# EAGLE schematic ccd_driver (EAGLE 9.1.3)

## Sheet 1 of 9: TODO
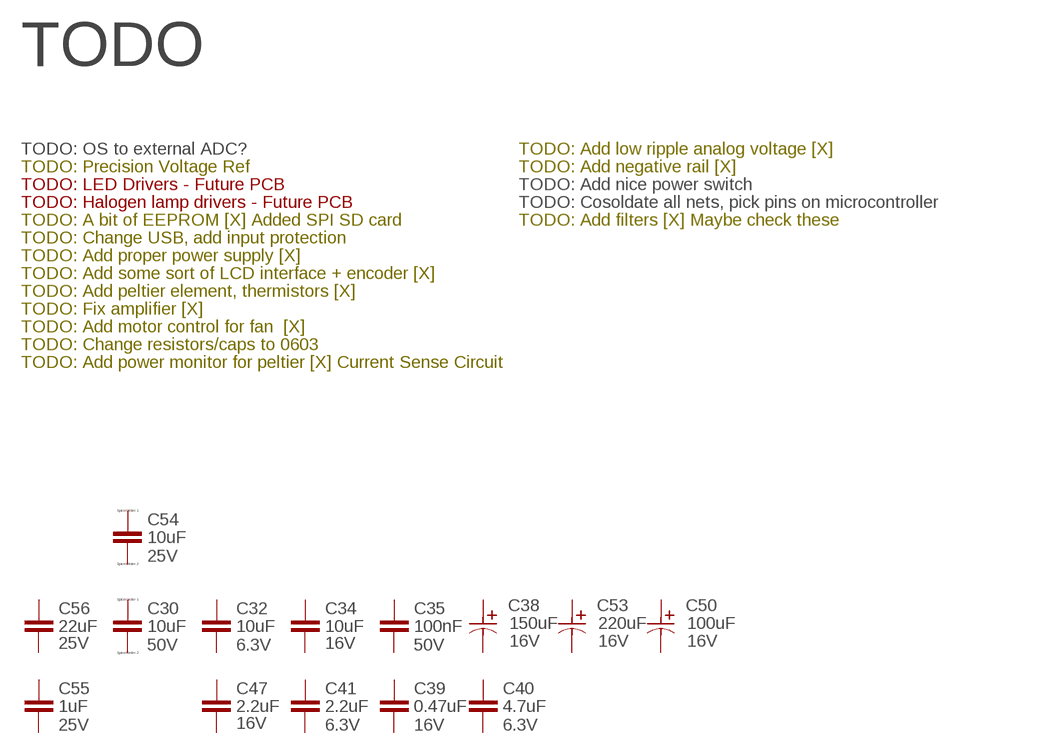
[diagram p0: schematic, sheet 1]

### Parts
C30  10uF  CC1206  [C1206]
C32  10uF  10PF-50V-5%(0603)  [0603-CAP]
C34  10uF  C-EUC0805  [C0805]
C35  100nF  10PF-50V-5%(0603)  [0603-CAP]
C38  UWZ1C151MCL1GS  [PCAP_6.3X7.7-ELECT]
C39  0.47uF  10PF-50V-5%(0603)  [0603-CAP]
C40  4.7uF  10PF-50V-5%(0603)  [0603-CAP]
C41  2.2uF  10PF-50V-5%(0603)  [0603-CAP]
C47  2.2uF  C-EUC0805  [C0805]
C50  EMVE160ADA101MF55G  UWZ1C151MCL1GS  [PCAP_6.3X7.7-ELECT]
C53  UWZ1C151MCL1GS  [PCAP_6.3X7.7-ELECT]
C54  10uF  CC1206  [C1206]
C55  1uF  10PF-50V-5%(0603)  [0603-CAP]
C56  22uF  C-EUC0805  [C0805]
Unconnected: C30.1 C30.2 C32.1 C32.2 C34.1 C34.2 C35.1 C35.2 C38.1 C38.2 C39.1 C39.2 C40.1 C40.2 C41.1 C41.2 C47.1 C47.2 C50.1 C50.2 C53.1 C53.2 C54.1 C54.2 C55.1 C55.2 C56.1 C56.2

### Notes on the sheet
- TODO: OS to external ADC? | TODO: Add low ripple analog voltage [X]
- TODO: Precision Voltage Ref | TODO: Add negative rail [X]
- TODO: LED Drivers - Future PCB | TODO: Add nice power switch
- TODO: Halogen lamp drivers - Future PCB | TODO: Cosoldate all nets, pick pins on microcontroller
- TODO: A bit of EEPROM [X] Added SPI SD card | TODO: Add filters [X] Maybe check these
- TODO: Change USB, add input protection
- TODO: Add proper power supply [X]
- TODO: Add some sort of LCD interface + encoder [X]
- TODO: Add peltier element, thermistors [X]
- TODO: Fix amplifier [X]
- TODO: Add motor control for fan  [X]
- TODO: Change resistors/caps to 0603
- TODO: Add power monitor for peltier [X] Current Sense Circuit

## Sheet 2 of 9: Power - Input
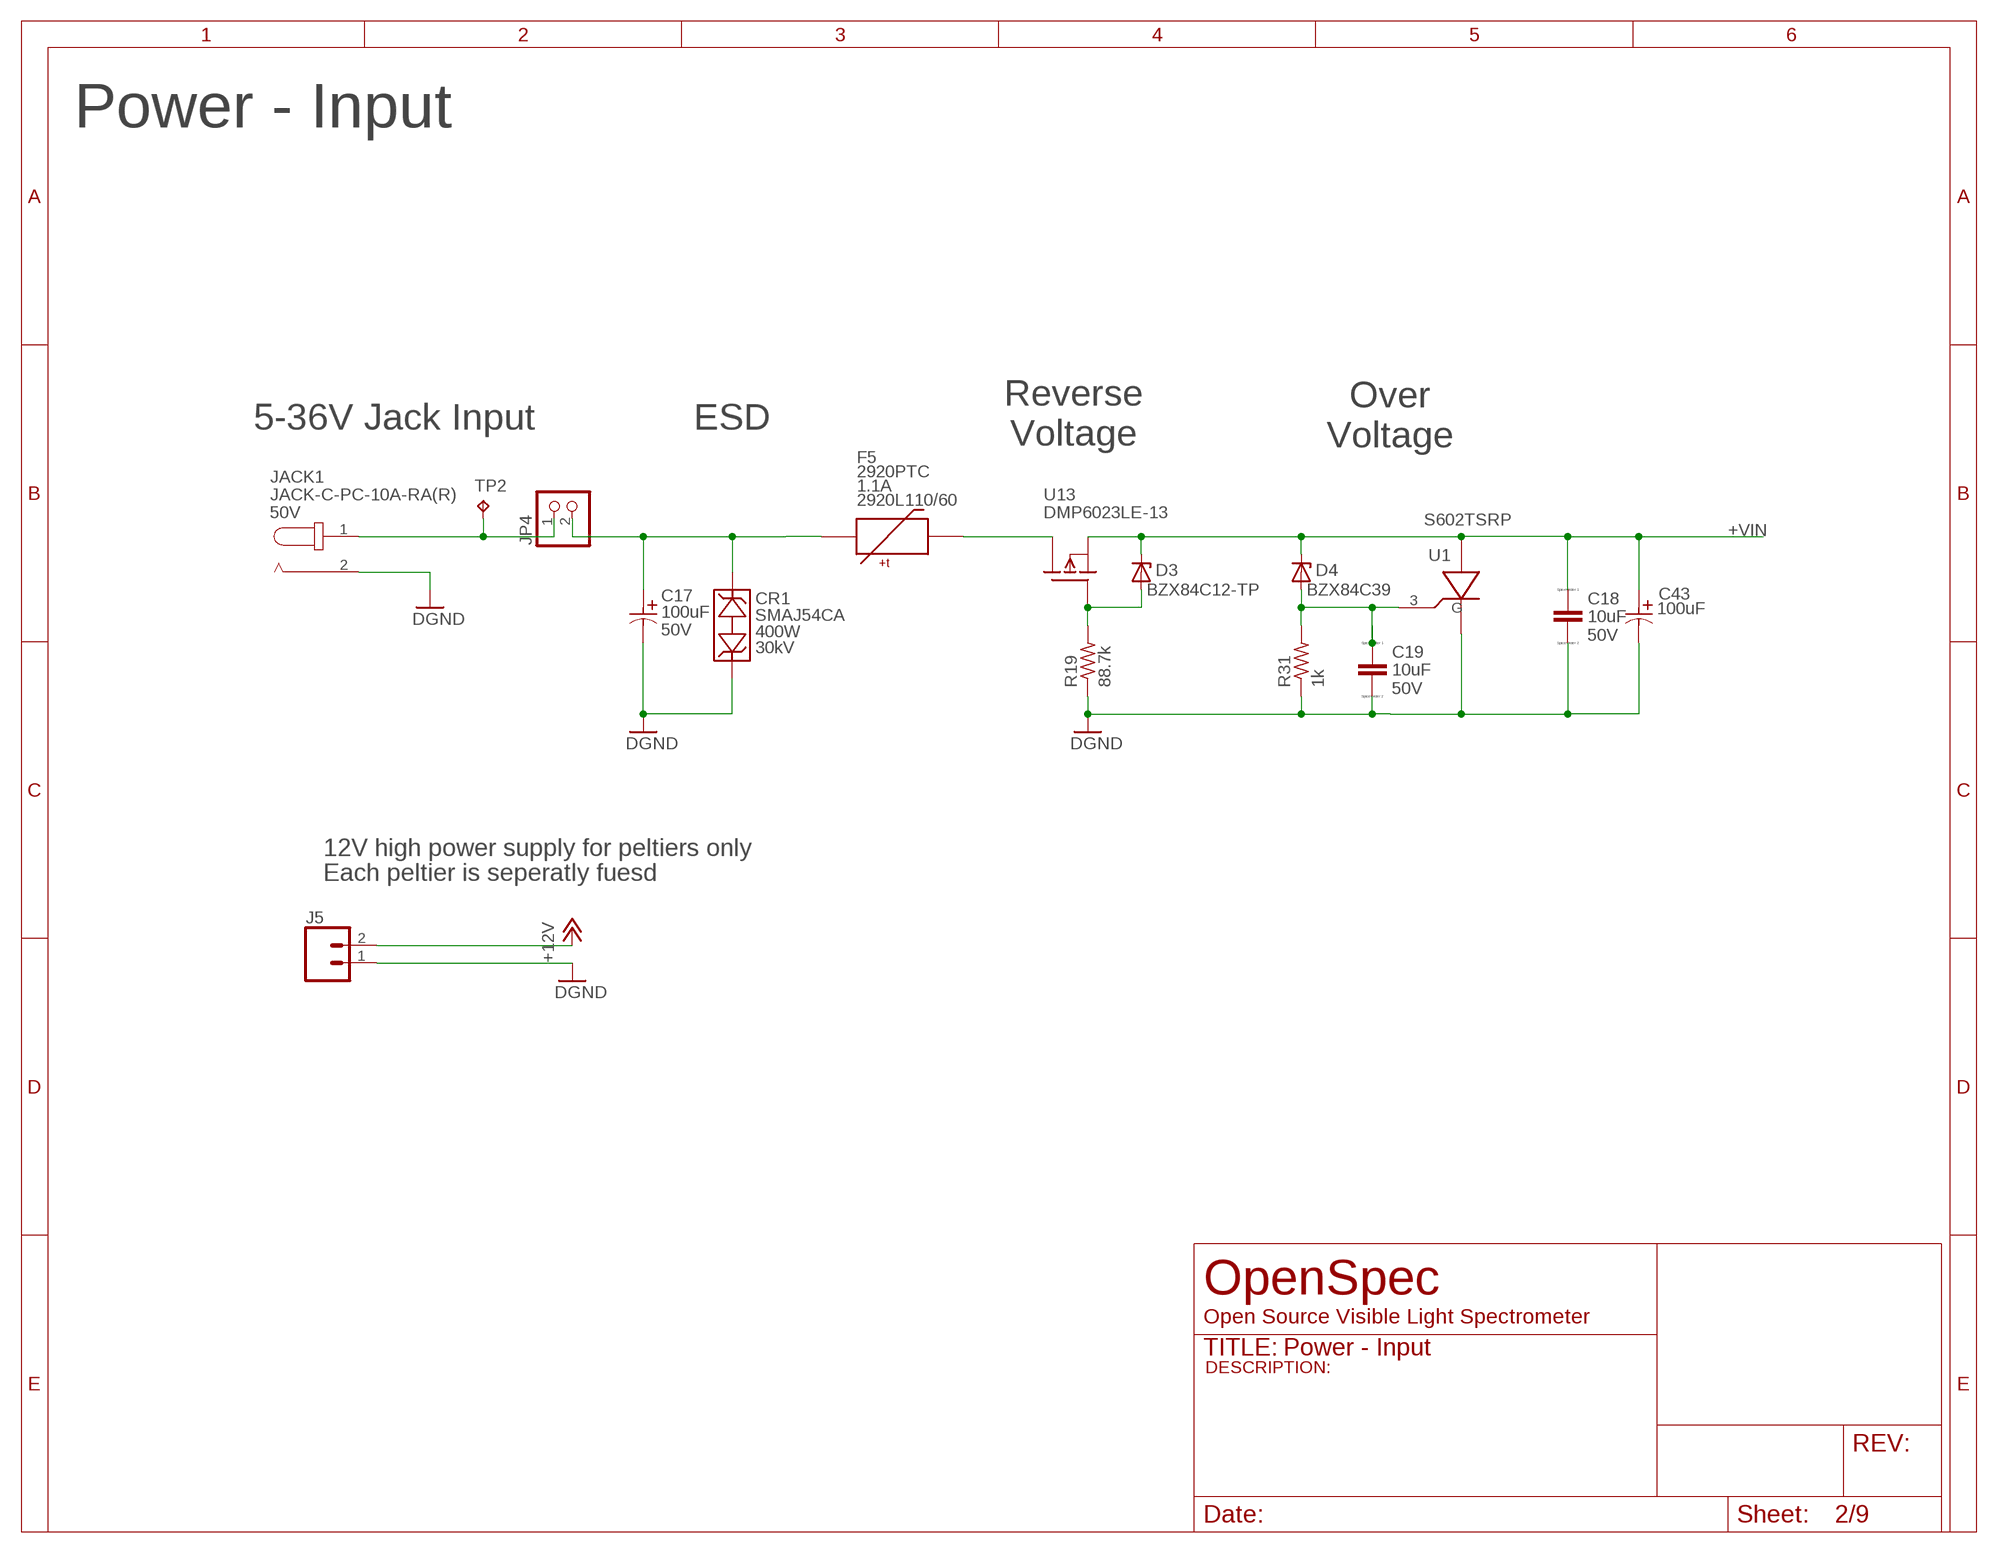
[diagram p1: schematic, sheet 2]

### Parts
C17  UWT1H101MNL1GS  [PCAP_8X10-ELECT]
C18  10uF  CC1206  [C1206]
C19  10uF  CC1206  [C1206]
C43  UWT1H101MNL1GS  [PCAP_8X10-ELECT]
CR1  SMAJ54CA  [SMASERIES]
D3  BZX84C12-TP  ZENER-DIODESOT23  [SOT23]
D4  BZX84C39  ZENER-DIODESOT23  [SOT23]
F5  2920PTC  [2920]
J5  CONN_023.5MM  [SCREWTERMINAL-3.5MM-2]
JACK1  JACK-C-PC-10A-RA(R)  [1939-1086-ND]
JP4  PINHD-1X2  [1X02]
R19  88.7k  R-US_R0603  [R0603]
R31  1k  R-US_R0603  [R0603]
TP2  TPPAD1-13  [P1-13]
U1  S602TSRP  BT168GW  [SOT223]
U13  DMP6023LE-13  [SOT-223]

### Nets
+12V: J5.2 ; also sheet 9
+VIN: C18.1 C43.1 D3.3(C) D4.3(C) U1.2(A) U13.3(S) ; also sheet 3
GND: C17.2 C18.2 C19.2 C43.2 CR1.2 J5.1 JACK1.2 R19.1 R31.1 U1.1(K) ; supply symbol labelled DGND ; also sheet 3,5,6,7,8,9
N$4: C17.1 CR1.1 F5.P$2 JP4.2
N$14: JACK1.1 JP4.1 TP2.TP
N$27: F5.P$1 U13.2(D) U13.TER(D)
N$33: D3.1(A) R19.2 U13.1(G)
N$34: C19.1 D4.1(A) R31.2 U1.3(G)

### Notes on the sheet
- 5-36V Jack Input | ESD
- Reverse
  Voltage
- Over
  Voltage
- 12V high power supply for peltiers only
- Each peltier is seperatly fuesd

## Sheet 3 of 9: Power - Regulators
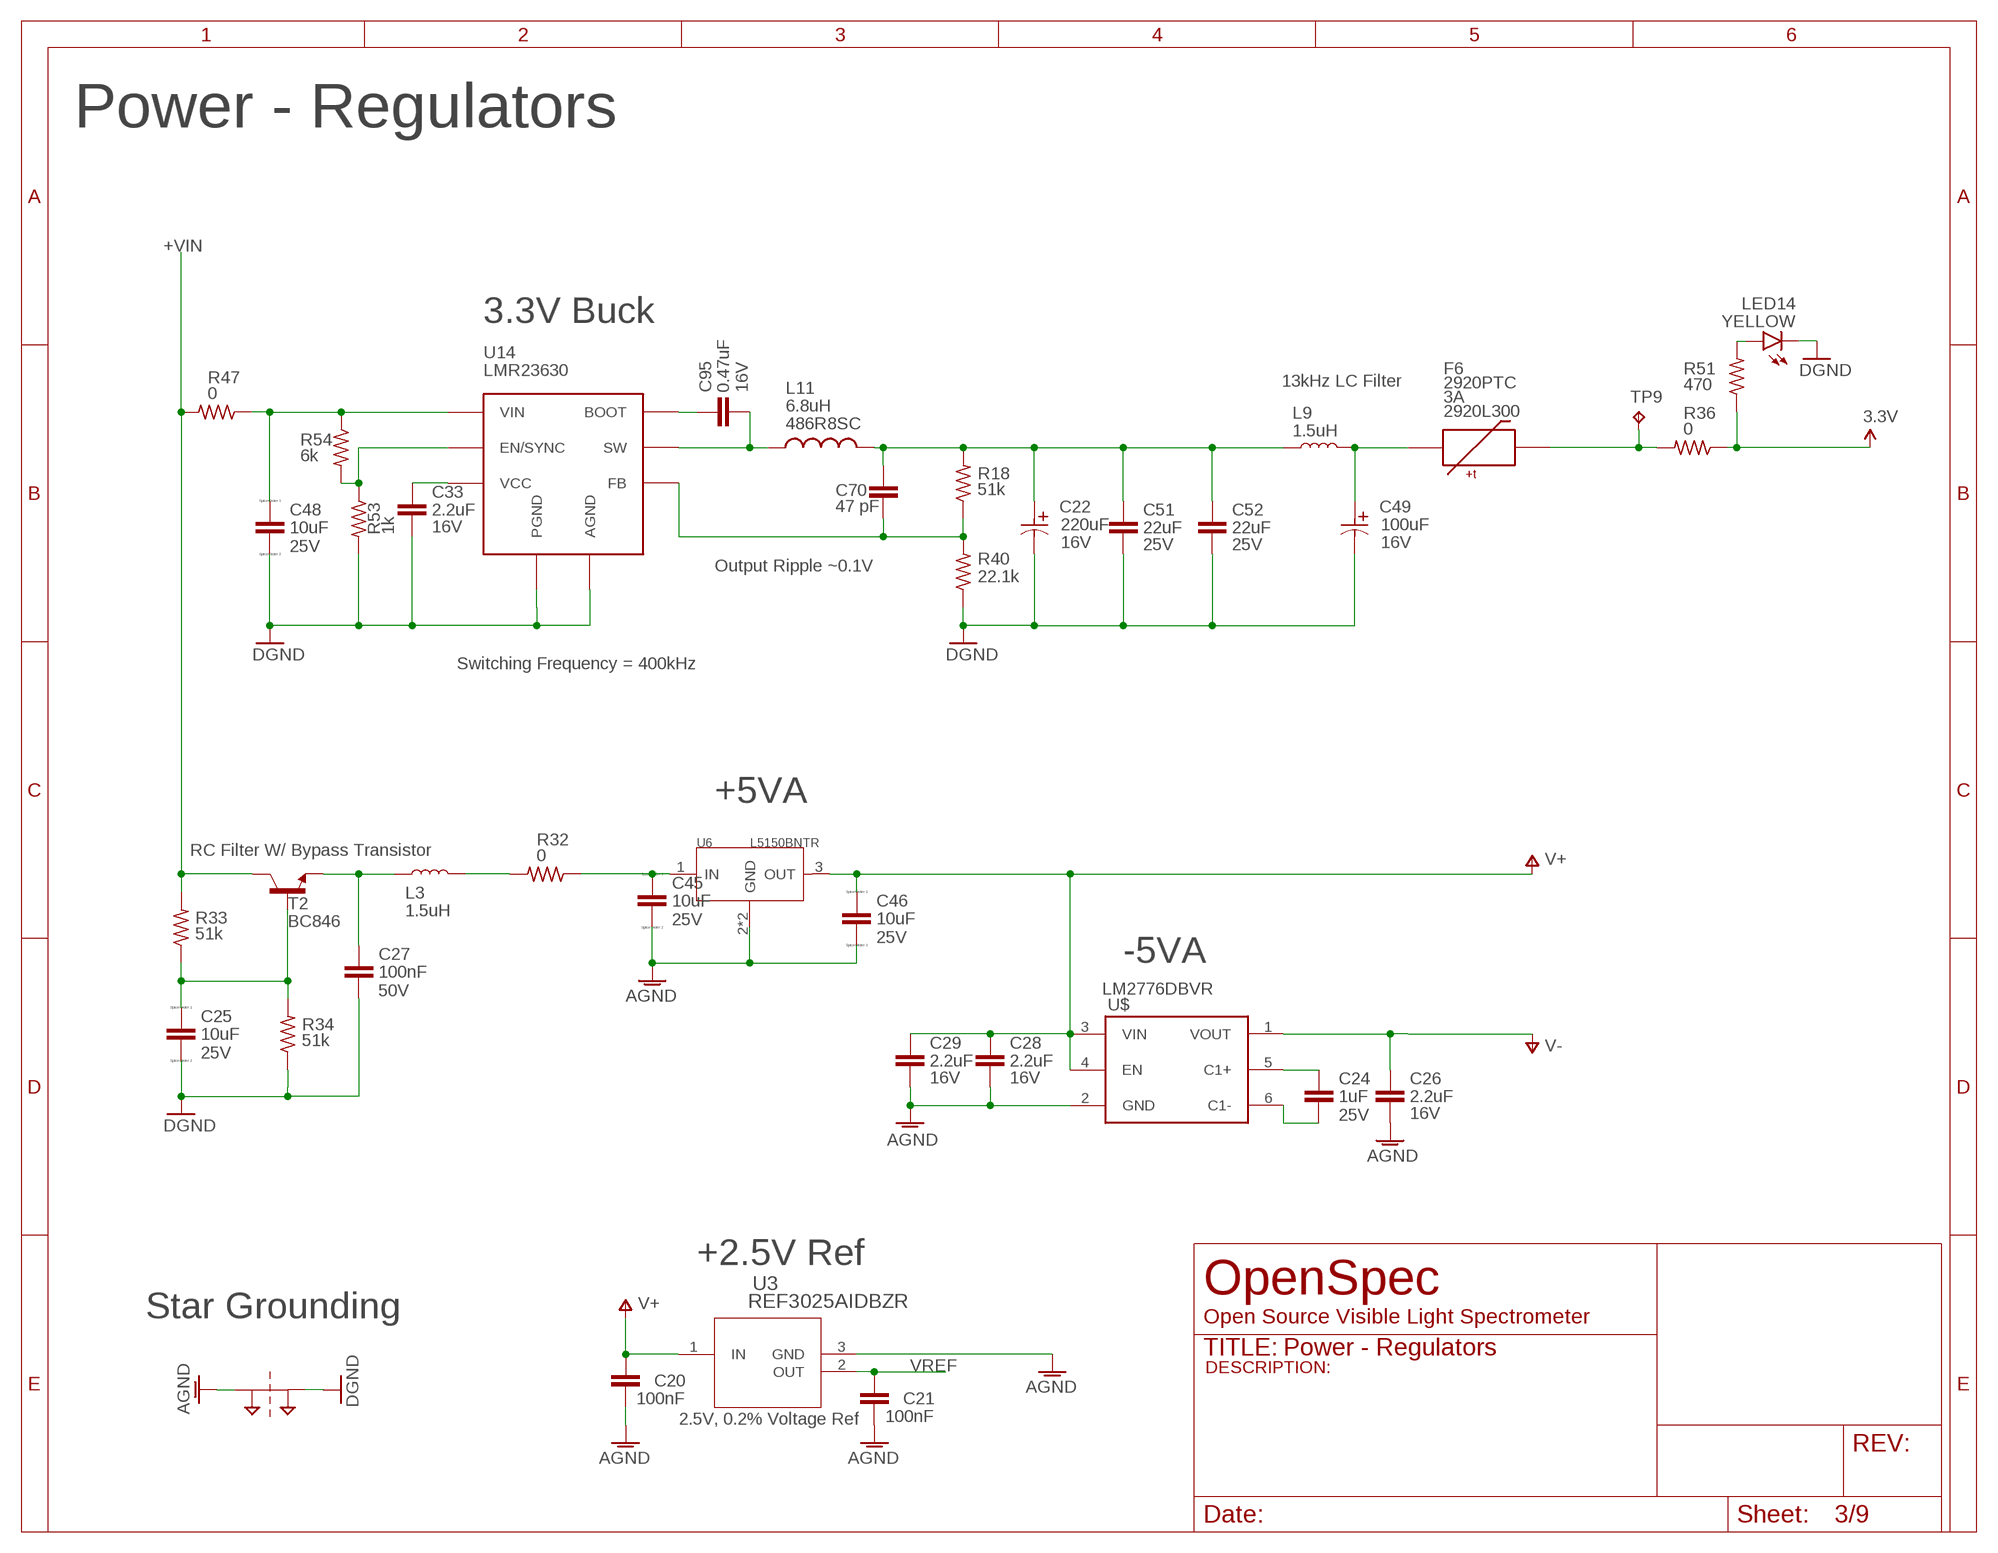
[diagram p2: schematic, sheet 3]

### Parts
C20  100nF  10PF-50V-5%(0603)  [0603-CAP]
C21  100nF  10PF-50V-5%(0603)  [0603-CAP]
C22  UWZ1C151MCL1GS  [PCAP_6.3X7.7-ELECT]
C24  1uF  10PF-50V-5%(0603)  [0603-CAP]
C25  10uF  CC1206  [C1206]
C26  2.2uF  C-EUC0805  [C0805]
C27  100nF  10PF-50V-5%(0603)  [0603-CAP]
C28  2.2uF  C-EUC0805  [C0805]
C29  2.2uF  C-EUC0805  [C0805]
C33  2.2uF  C-EUC0805  [C0805]
C45  10uF  CC1206  [C1206]
C46  10uF  CC1206  [C1206]
C48  10uF  CC1206  [C1206]
C49  EMVE160ADA101MF55G  UWZ1C151MCL1GS  [PCAP_6.3X7.7-ELECT]
C51  22uF  C-EUC0805  [C0805]
C52  22uF  C-EUC0805  [C0805]
C70  47 pF  10PF-50V-5%(0603)  [0603-CAP]
C95  0.47uF  10PF-50V-5%(0603)  [0603-CAP]
F6  2920PTC  [2920]
L3  CIGW252010GLR47MNE  [2520]
L9  CIGW252010GLR47MNE  [2520]
L11  486R8SC  [486R8SC]
LED14  SML-LX23  [3X2SMDLED]
R18  51k  R-US_R0603  [R0603]
R32  0  R-US_R0603  [R0603]
R33  51k  R-US_R0603  [R0603]
R34  51k  R-US_R0603  [R0603]
R36  0  R-US_R0603  [R0603]
R40  22.1k  R-US_R0603  [R0603]
R47  0  R-US_R0603  [R0603]
R51  470  R-US_R0603  [R0603]
R53  1k  R-US_R0603  [R0603]
R54  6k  R-US_R0603  [R0603]
SUPPLY21  2PT_GND_TIE  [2PT_GND_TIE]
T2  BC846  [SOT23]
TP9  TPPAD1-13  [P1-13]
U3  REF3025AIDBZR  [DBZ3]
U6  L5150BNTR  [SOT-223]
U14  LMR23630  [HSOIC-8]
U$  LM2776DBVR  [SOT23-6]

### Nets
3.3V: R36.1 R51.1 ; also sheet 4,5,7,8,9
+VIN: R33.2 R47.2 T2.3(C) ; also sheet 2
AGND: C20.2 C21.2 C26.2 C28.2 C29.2 C45.2 C46.2 SUPPLY21.P$1 U3.3(GND) U6.2(GND) U6.TER(GND) U$.2(GND) ; also sheet 4
GND: C22.2 C25.2 C27.2 C33.2 C48.2 C49.2 C51.2 C52.2 LED14.C R34.1 R40.1 R53.2 SUPPLY21.P$2 U14.P$6(AGND) U14.P$8(PGND) U14.PAD0(PGND) U14.PAD1(PGND) U14.PAD2(PGND) U14.PAD3(PGND) U14.PAD4(PGND) U14.PAD5(PGND) U14.PAD6(PGND) ; supply symbol labelled DGND ; also sheet 2,5,6,7,8,9
N$35: C45.1 R32.1 U6.1(IN)
N$36: L3.2 R32.2
N$38: C25.1 R33.1 R34.2 T2.1(B)
N$39: C27.1 L3.1 T2.2(E)
N$61: C33.1 U14.P$3(VCC)
N$66: R53.1 R54.2 U14.P$5(EN/SYNC)
N$67: C48.1 R47.1 R54.1 U14.P$7(VIN)
N$70: C70.2 R18.1 R40.2 U14.P$4(FB)
N$76: C95.2 L11.P$1 U14.P$1(SW)
N$79: C95.1 U14.P$2(BOOT)
N$88: C22.1 C51.1 C52.1 C70.1 L9.1 L11.P$2 R18.2
N$89: F6.P$1 R36.2 TP9.TP
N$91: LED14.A R51.2
N$93: C24.1 U$.5(C1+)
N$94: C24.2 U$.6(C1-)
N$95: C49.1 F6.P$2 L9.2
V+: C20.1 C28.1 C29.1 C46.1 U3.1(IN) U6.3(OUT) U$.3(VIN) U$.4(EN) ; also sheet 4
V-: C26.1 U$.1(VOUT) ; also sheet 4
VREF: C21.1 U3.2(OUT)

### Notes on the sheet
- 3.3V Buck
- 13kHz LC Filter
- Output Ripple ~0.1V
- Switching Frequency = 400kHz
- +5VA
- RC Filter W/ Bypass Transistor
- -5VA
- +2.5V Ref
- Star Grounding
- 2.5V, 0.2% Voltage Ref

## Sheet 4 of 9: CCD, Analog, & ADC
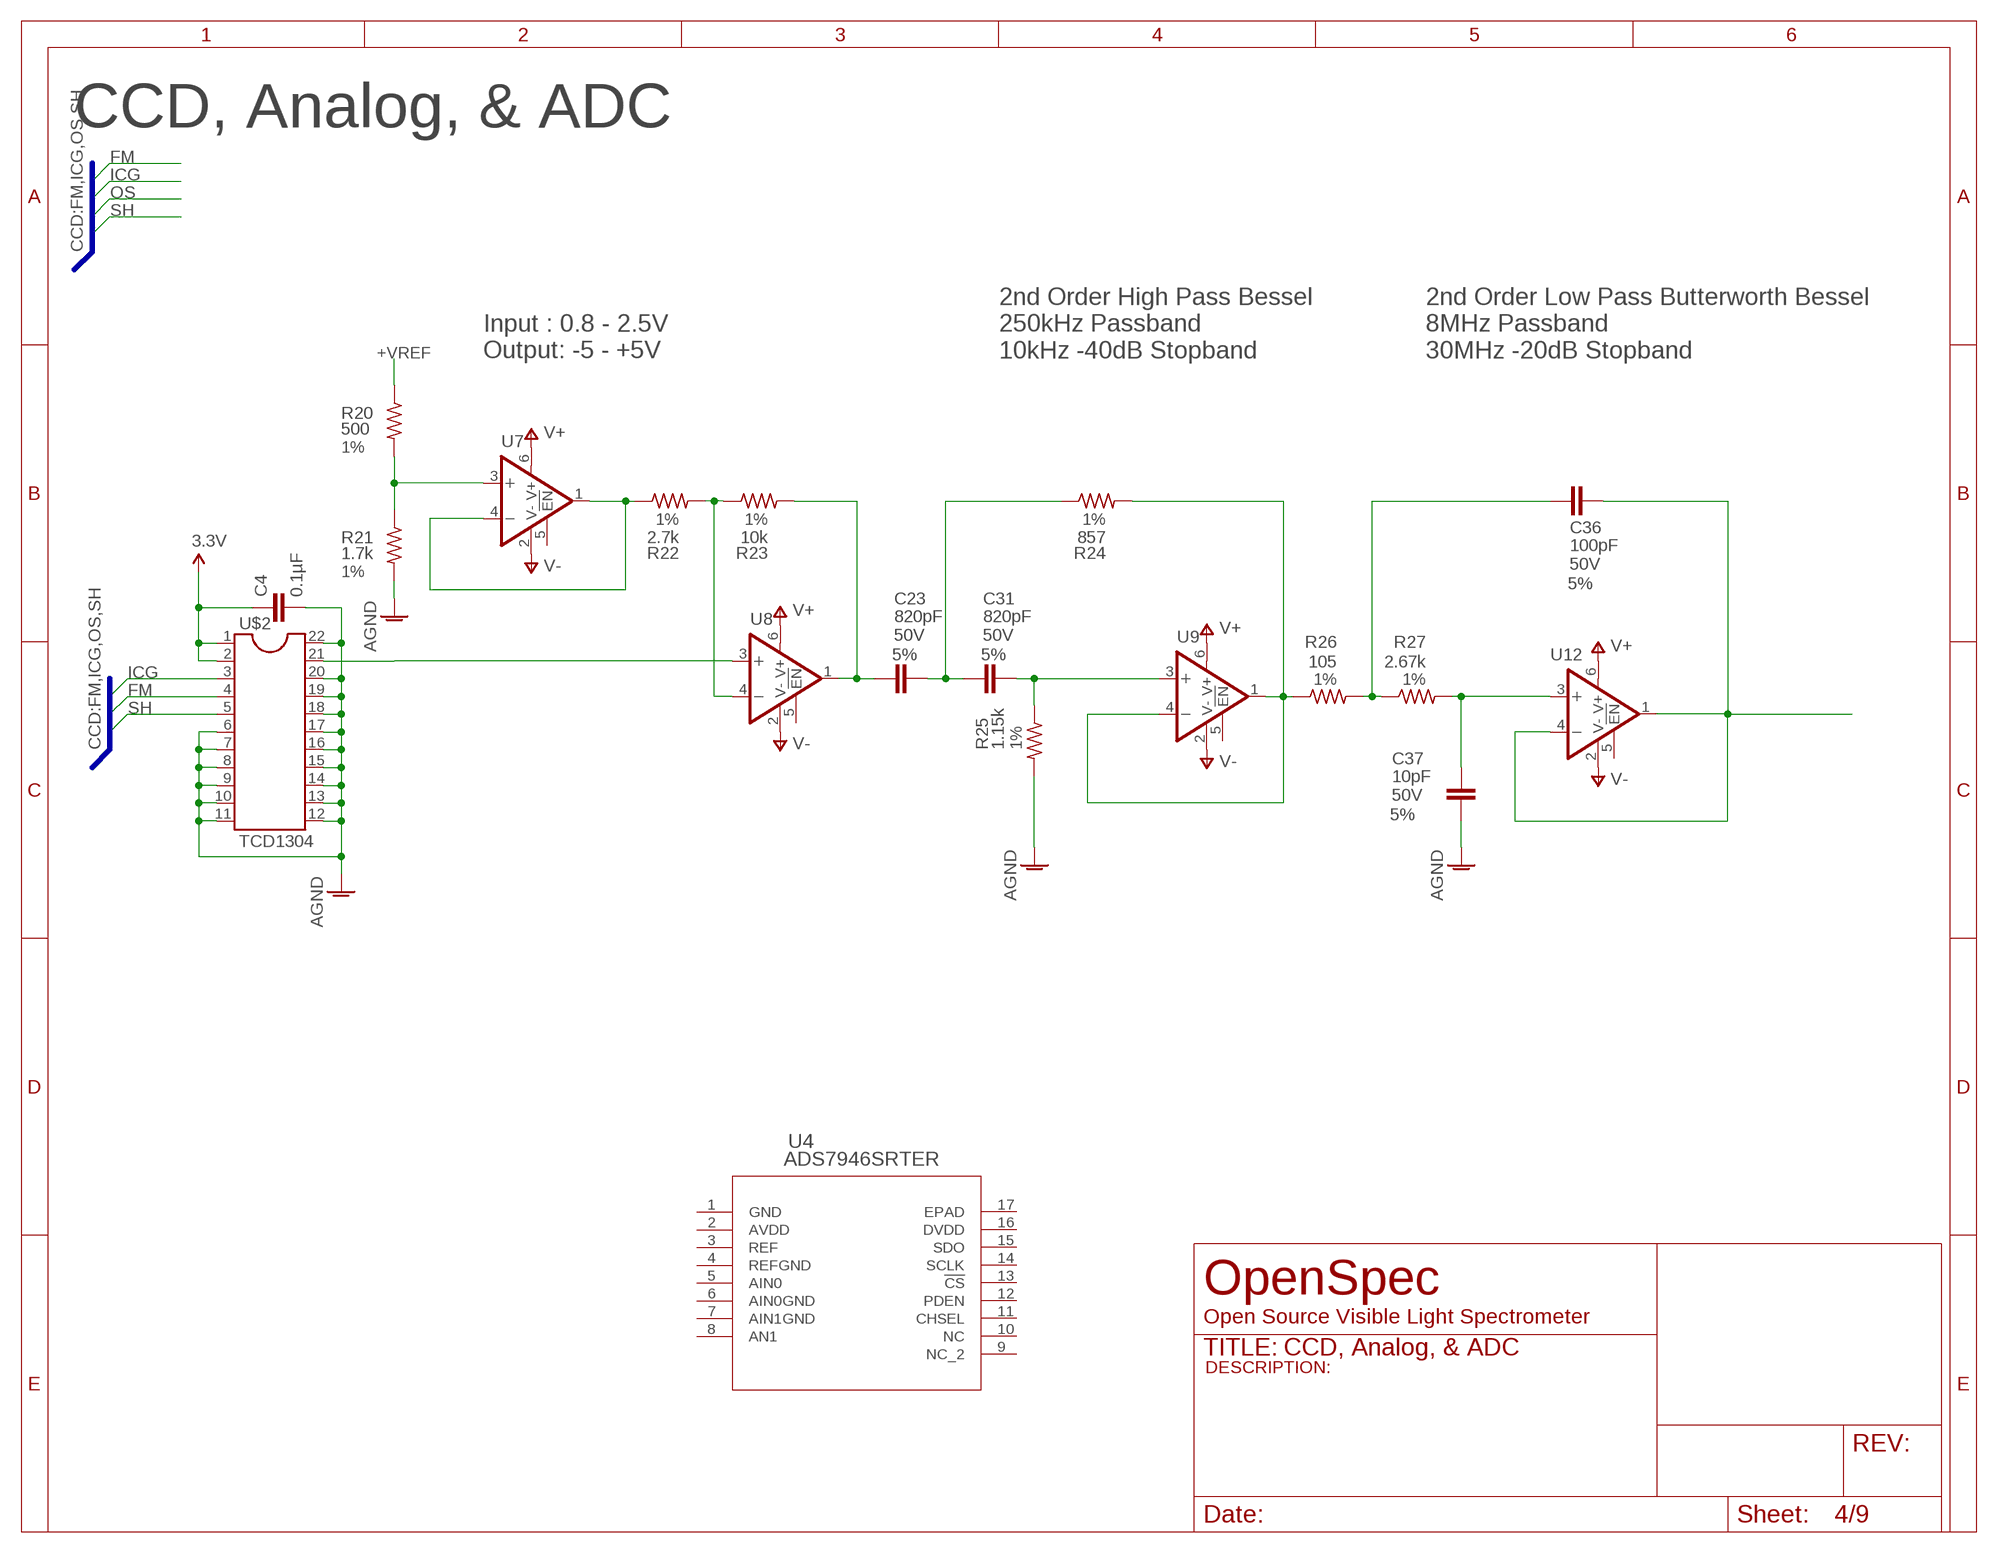
[diagram p3: schematic, sheet 4]

### Parts
C4  0.1µF  C-EUC1206  [C1206]
C23  820pF  10PF-50V-5%(0603)  [0603-CAP]
C31  820pF  10PF-50V-5%(0603)  [0603-CAP]
C36  100pF  10PF-50V-5%(0603)  [0603-CAP]
C37  10pF  10PF-50V-5%(0603)  [0603-CAP]
R20  500  R-US_R0603  [R0603]
R21  1.7k  R-US_R0603  [R0603]
R22  2.7k  R-US_R0603  [R0603]
R23  10k  R-US_R0603  [R0603]
R24  857  R-US_R0603  [R0603]
R25  1.15k  R-US_R0603  [R0603]
R26  105  R-US_R0603  [R0603]
R27  2.67k  R-US_R0603  [R0603]
U4  ADS7946SRTER  [RTE16_1P7X1P7]
U7  ADA4807-1ARJZ-R2  [RJ_6]
U8  ADA4807-1ARJZ-R2  [RJ_6]
U9  ADA4807-1ARJZ-R2  [RJ_6]
U12  ADA4807-1ARJZ-R2  [RJ_6]
U$2  TCD1304  [TCD1304]

### Nets
3.3V: C4.1 U$2.1 U$2.2 ; also sheet 3,5,7,8,9
+VREF: R20.1
AGND: C4.2 C37.1 R21.2 R25.2 U$2.6 U$2.7 U$2.8 U$2.9 U$2.10 U$2.11 U$2.12 U$2.13 U$2.14 U$2.15 U$2.16 U$2.17 U$2.18 U$2.19 U$2.20 U$2.22 ; also sheet 3
FM: U$2.4 ; also sheet 7
ICG: U$2.3 ; also sheet 7
N$5: U8.3(+IN) U$2.21
N$6: R20.2 R21.1 U7.3(+IN)
N$25: R22.1 U7.1(OUT) U7.4(-IN)
N$28: R22.2 R23.1 U8.4(-IN)
N$29: C23.1 R23.2 U8.1(OUT)
N$30: C23.2 C31.1 R24.1
N$31: C31.2 R25.1 U9.3(+IN)
N$32: R24.2 R26.1 U9.1(OUT) U9.4(-IN)
N$40: C37.2 R27.2 U12.3(+IN)
N$41: C36.1 R26.2 R27.1
N$42: C36.2 U12.1(OUT) U12.4(-IN)
SH: U$2.5 ; also sheet 7
V+: U7.6(V+) U8.6(V+) U9.6(V+) U12.6(V+) ; also sheet 3
V-: U7.2(V-) U8.2(V-) U9.2(V-) U12.2(V-) ; also sheet 3
Unconnected: U4.5(AIN0) U4.6(AIN0GND) U4.7(AIN1GND) U4.8(AN1) U4.9(NC_2) U4.10(NC) U4.11(CHSEL) U4.12(PDEN) U4.13(!CS) U4.14(SCLK) U4.15(SDO) U7.5(!EN) U8.5(!EN) U9.5(!EN) U12.5(!EN)

### Buses
CCD:FM,ICG,OS,SH

### Notes on the sheet
- Input : 0.8 - 2.5V
  Output: -5 - +5V
- 2nd Order High Pass Bessel
  250kHz Passband
  10kHz -40dB Stopband
- 2nd Order Low Pass Butterworth Bessel
  8MHz Passband
  30MHz -20dB Stopband

## Sheet 5 of 9: TFT Screen & Encoder
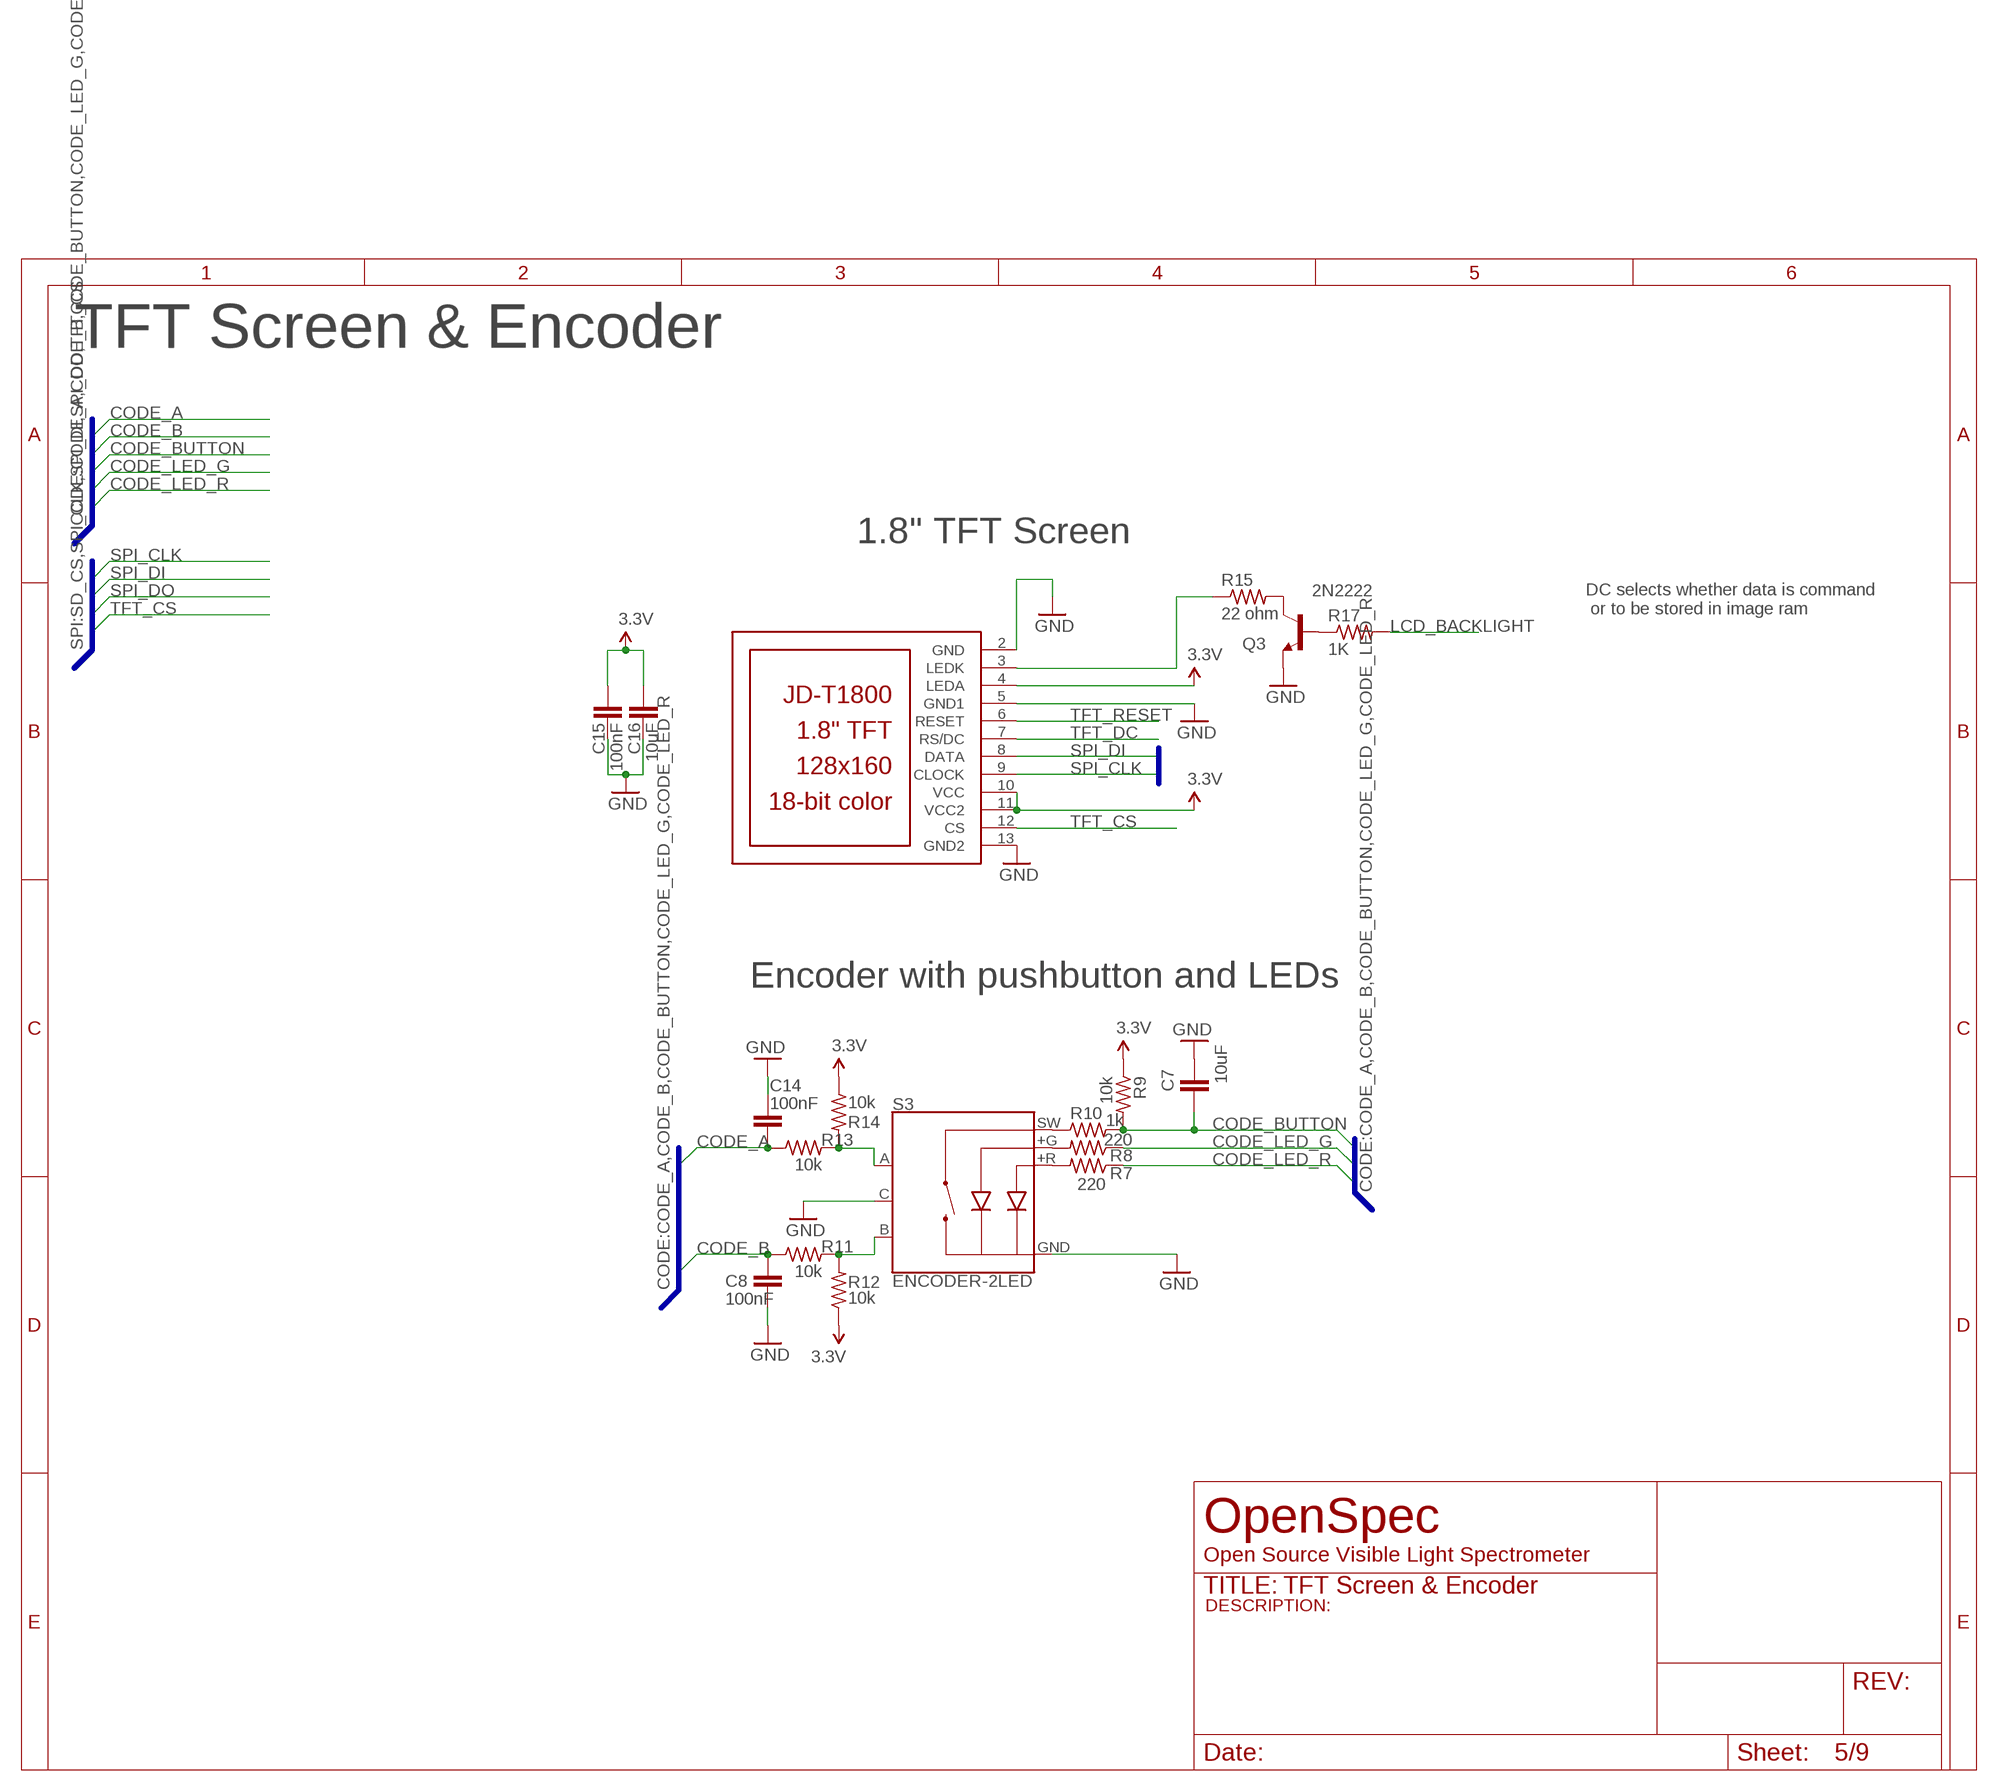
[diagram p4: schematic, sheet 5]

### Parts
C7  10uF  10PF-50V-5%(0603)  [0603-CAP]
C8  100nF  10PF-50V-5%(0603)  [0603-CAP]
C14  100nF  10PF-50V-5%(0603)  [0603-CAP]
C15  100nF  10PF-50V-5%(0603)  [0603-CAP]
C16  10uF  10PF-50V-5%(0603)  [0603-CAP]
Q3  2N2222  MMBT2222ALT1-NPN-SOT23-BEC  [SOT23-BEC]
R7  220  R-US_R0603  [R0603]
R8  220  R-US_R0603  [R0603]
R9  10k  R-US_R0603  [R0603]
R10  1k  R-US_R0603  [R0603]
R11  10k  R-US_R0603  [R0603]
R12  10k  R-US_R0603  [R0603]
R13  10k  R-US_R0603  [R0603]
R14  10k  R-US_R0603  [R0603]
R15  22 ohm  R-US_R0805  [R0805]
R17  1K  R-US_R0805  [R0805]
S3  ENCODER-2LED  [ENCODER_LED_2]
U$10  JD-T1800  [JD-T1800]

### Nets
3.3V: C15.1 C16.1 R9.1 R12.1 R14.1 U$10.4(LEDA) U$10.10(VCC) U$10.11(VCC2) ; also sheet 3,4,7,8,9
CODE_A: C14.2 R13.1
CODE_B: C8.1 R11.1
CODE_BUTTON: C7.2 R9.2 R10.2
CODE_LED_G: R8.1
CODE_LED_R: R7.1
GND: C7.1 C8.2 C14.1 C15.2 C16.2 Q3.E S3.C S3.GND(-) U$10.2(GND) U$10.5(GND1) U$10.13(GND2) ; also sheet 2,3,6,7,8,9
LCD_BACKLIGHT: R17.2
N$3: R7.2 S3.+R
N$8: R8.2 S3.+G
N$9: R10.1 S3.SW
N$10: R13.2 R14.2 S3.A
N$20: R11.2 R12.2 S3.B
N$22: R15.1 U$10.3(LEDK)
N$23: Q3.C R15.2
N$24: Q3.B R17.1
SPI_CLK: U$10.9(CLOCK) ; also sheet 8
SPI_DI: U$10.8(DATA) ; also sheet 8
TFT_CS: U$10.12(CS)
TFT_DC: U$10.7(RS/DC)
TFT_RESET: U$10.6(RESET)

### Buses
SPI:SD_CS,SPI_CLK,SPI_DI,SPI_DO,TFT_CS
CODE:CODE_A,CODE_B,CODE_BUTTON,CODE_LED_G,CODE_LED_R
GND,CODE_LED_R,CODE_LED_G,CODE_BUTTON,N$20,CODE_B,N$10,CODE_A

### Notes on the sheet
- 1.8" TFT Screen
- DC selects whether data is command
   or to be stored in image ram
- Encoder with pushbutton and LEDs

## Sheet 6 of 9: USB Input
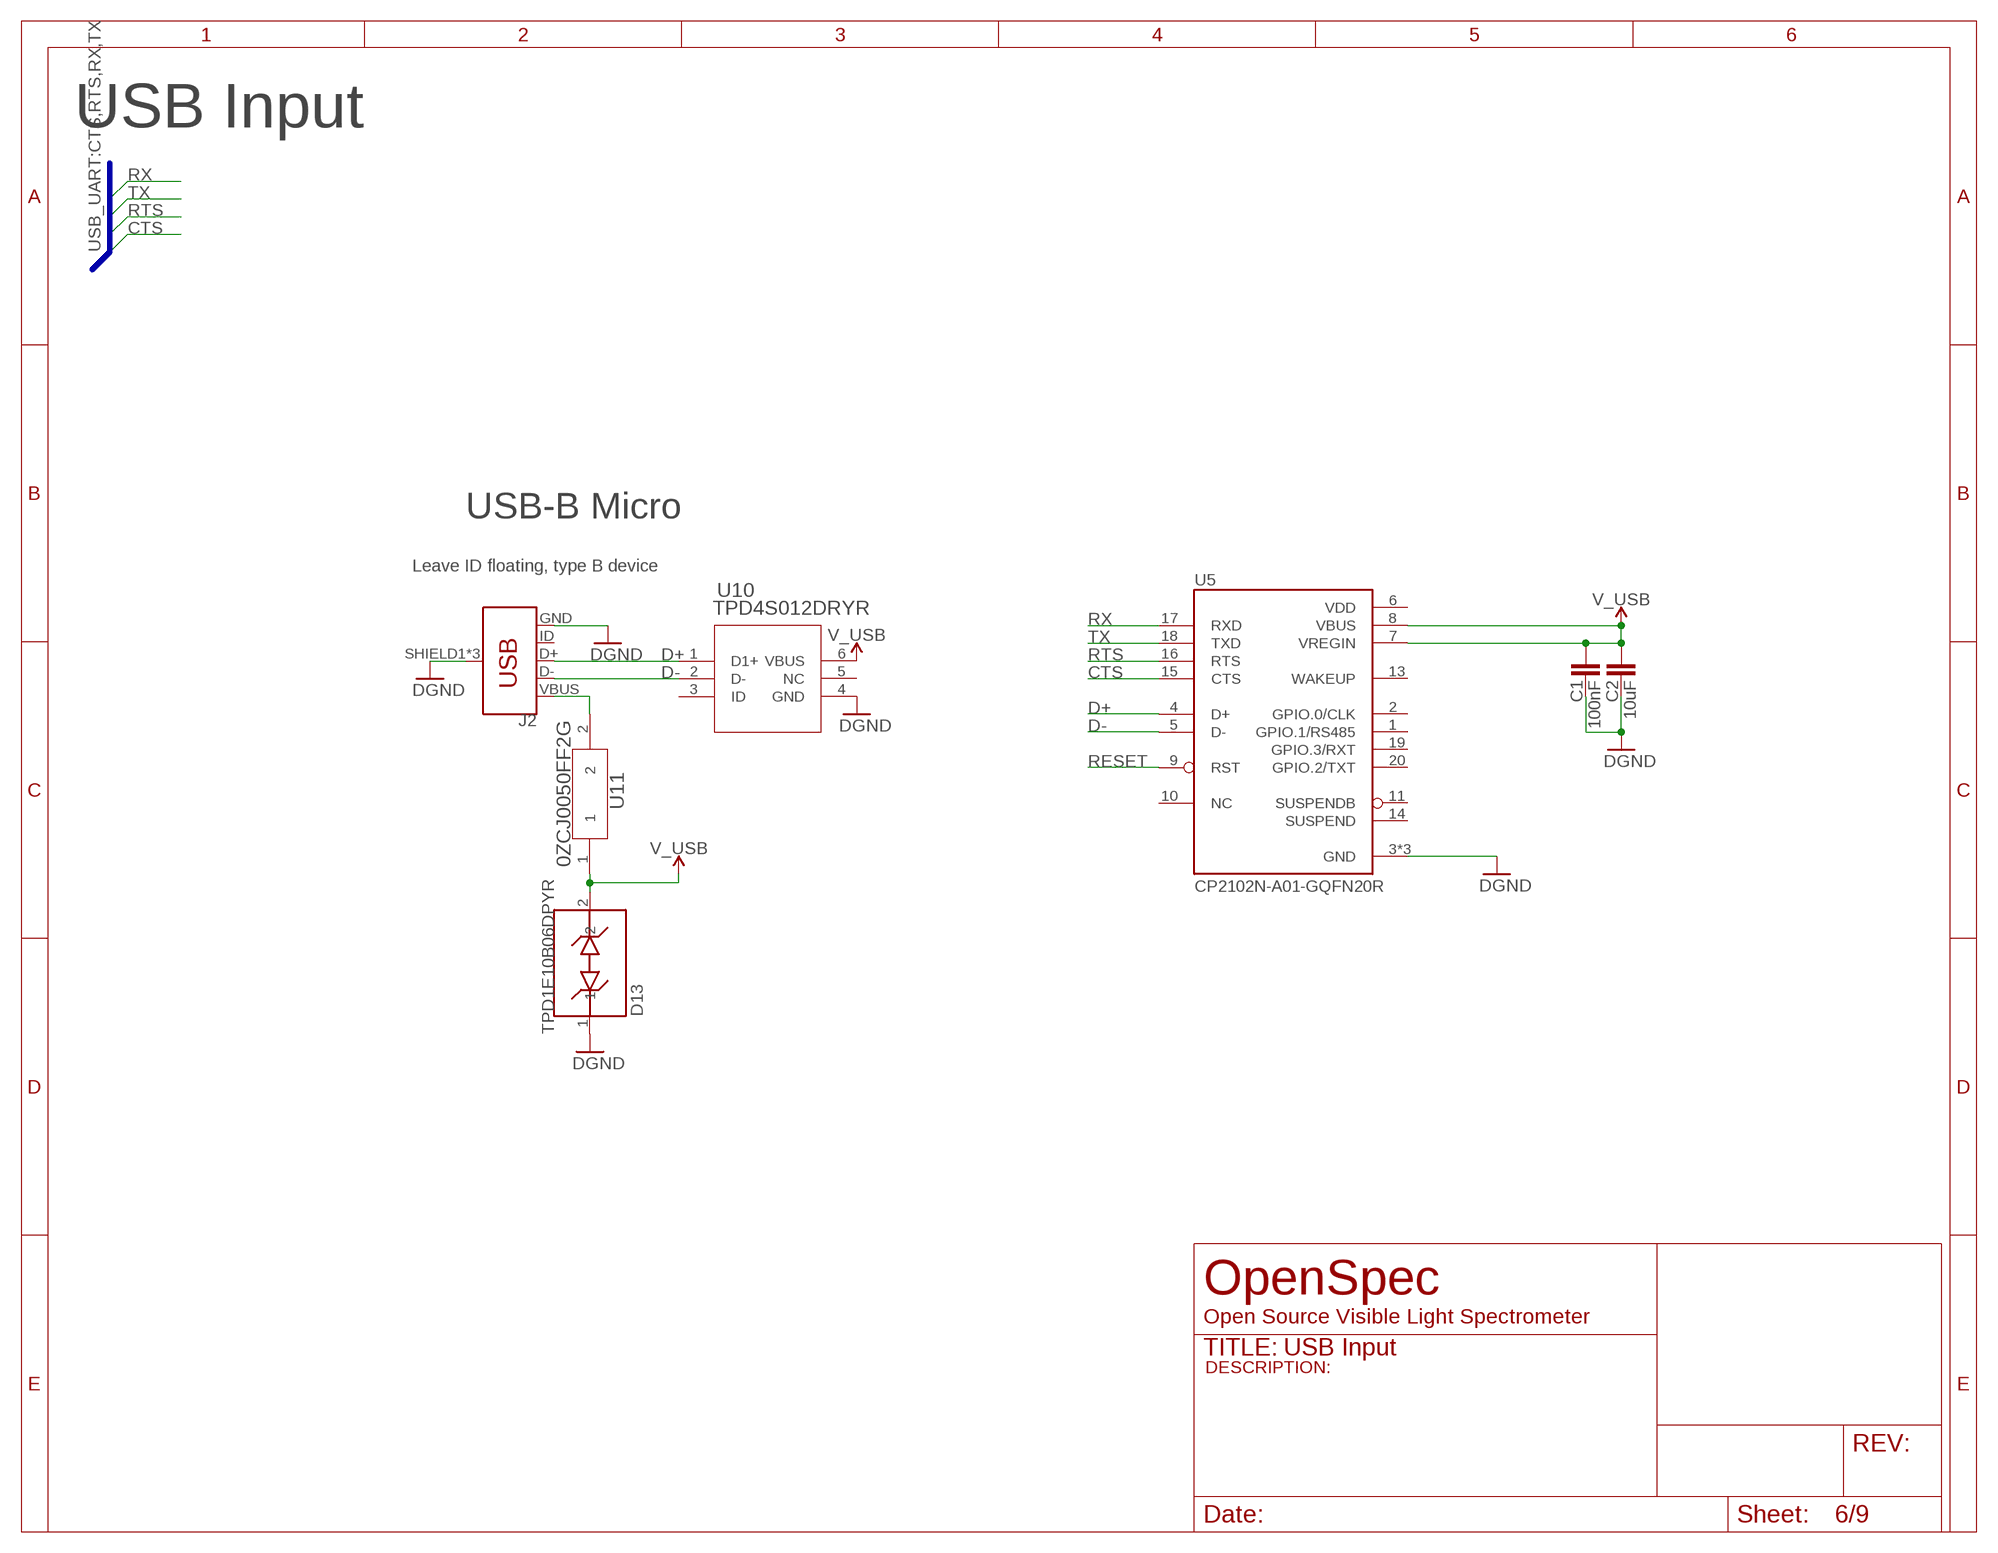
[diagram p5: schematic, sheet 6]

### Parts
C1  100nF  10PF-50V-5%(0603)  [0603-CAP]
C2  10uF  10PF-50V-5%(0603)  [0603-CAP]
D13  TPD1E10B06DPYR  [DFN100X60X45-2N]
J2  USB_MICRO-B_FEMALE-SMT  [USB-B-MICRO-SMD]
U5  CP2102N-A01-GQFN20R  [SILABS_QFN20]
U10  TPD4S012DRYR  [DRY6]
U11  0ZCJ0050FF2G  [0ZCJ]

### Nets
CTS: U5.15(CTS) ; also sheet 7
D+: J2.D+ U5.4(D+) U10.1(D1+)
D-: J2.D- U5.5(D-) U10.2(D-)
GND: C1.2 C2.2 D13.1 J2.GND J2.SHIELD1(SHIELD) J2.SHIELD2(SHIELD) J2.SHIELD3(SHIELD) U5.3(GND) U5.12(GND) U5.21(GND) U10.4(GND) ; supply symbol labelled DGND ; also sheet 2,3,5,7,8,9
N$19: J2.VBUS U11.2
RESET: U5.9(RST) ; also sheet 7
RTS: U5.16(RTS) ; also sheet 7
RX: U5.17(RXD) ; also sheet 7
TX: U5.18(TXD) ; also sheet 7
V_USB: C1.1 C2.1 D13.2 U5.7(VREGIN) U5.8(VBUS) U10.6(VBUS) U11.1
Unconnected: J2.ID U5.1(GPIO.1/RS485) U5.2(GPIO.0/CLK) U5.10(NC) U5.11(SUSPENDB) U5.13(WAKEUP) U5.14(SUSPEND) U5.19(GPIO.3/RXT) U5.20(GPIO.2/TXT) U10.3(ID) U10.5(NC)

### Buses
USB_UART:CTS,RTS,RX,TX

### Notes on the sheet
- USB-B Micro
- Leave ID floating, type B device

## Sheet 7 of 9: Main Microcontroller
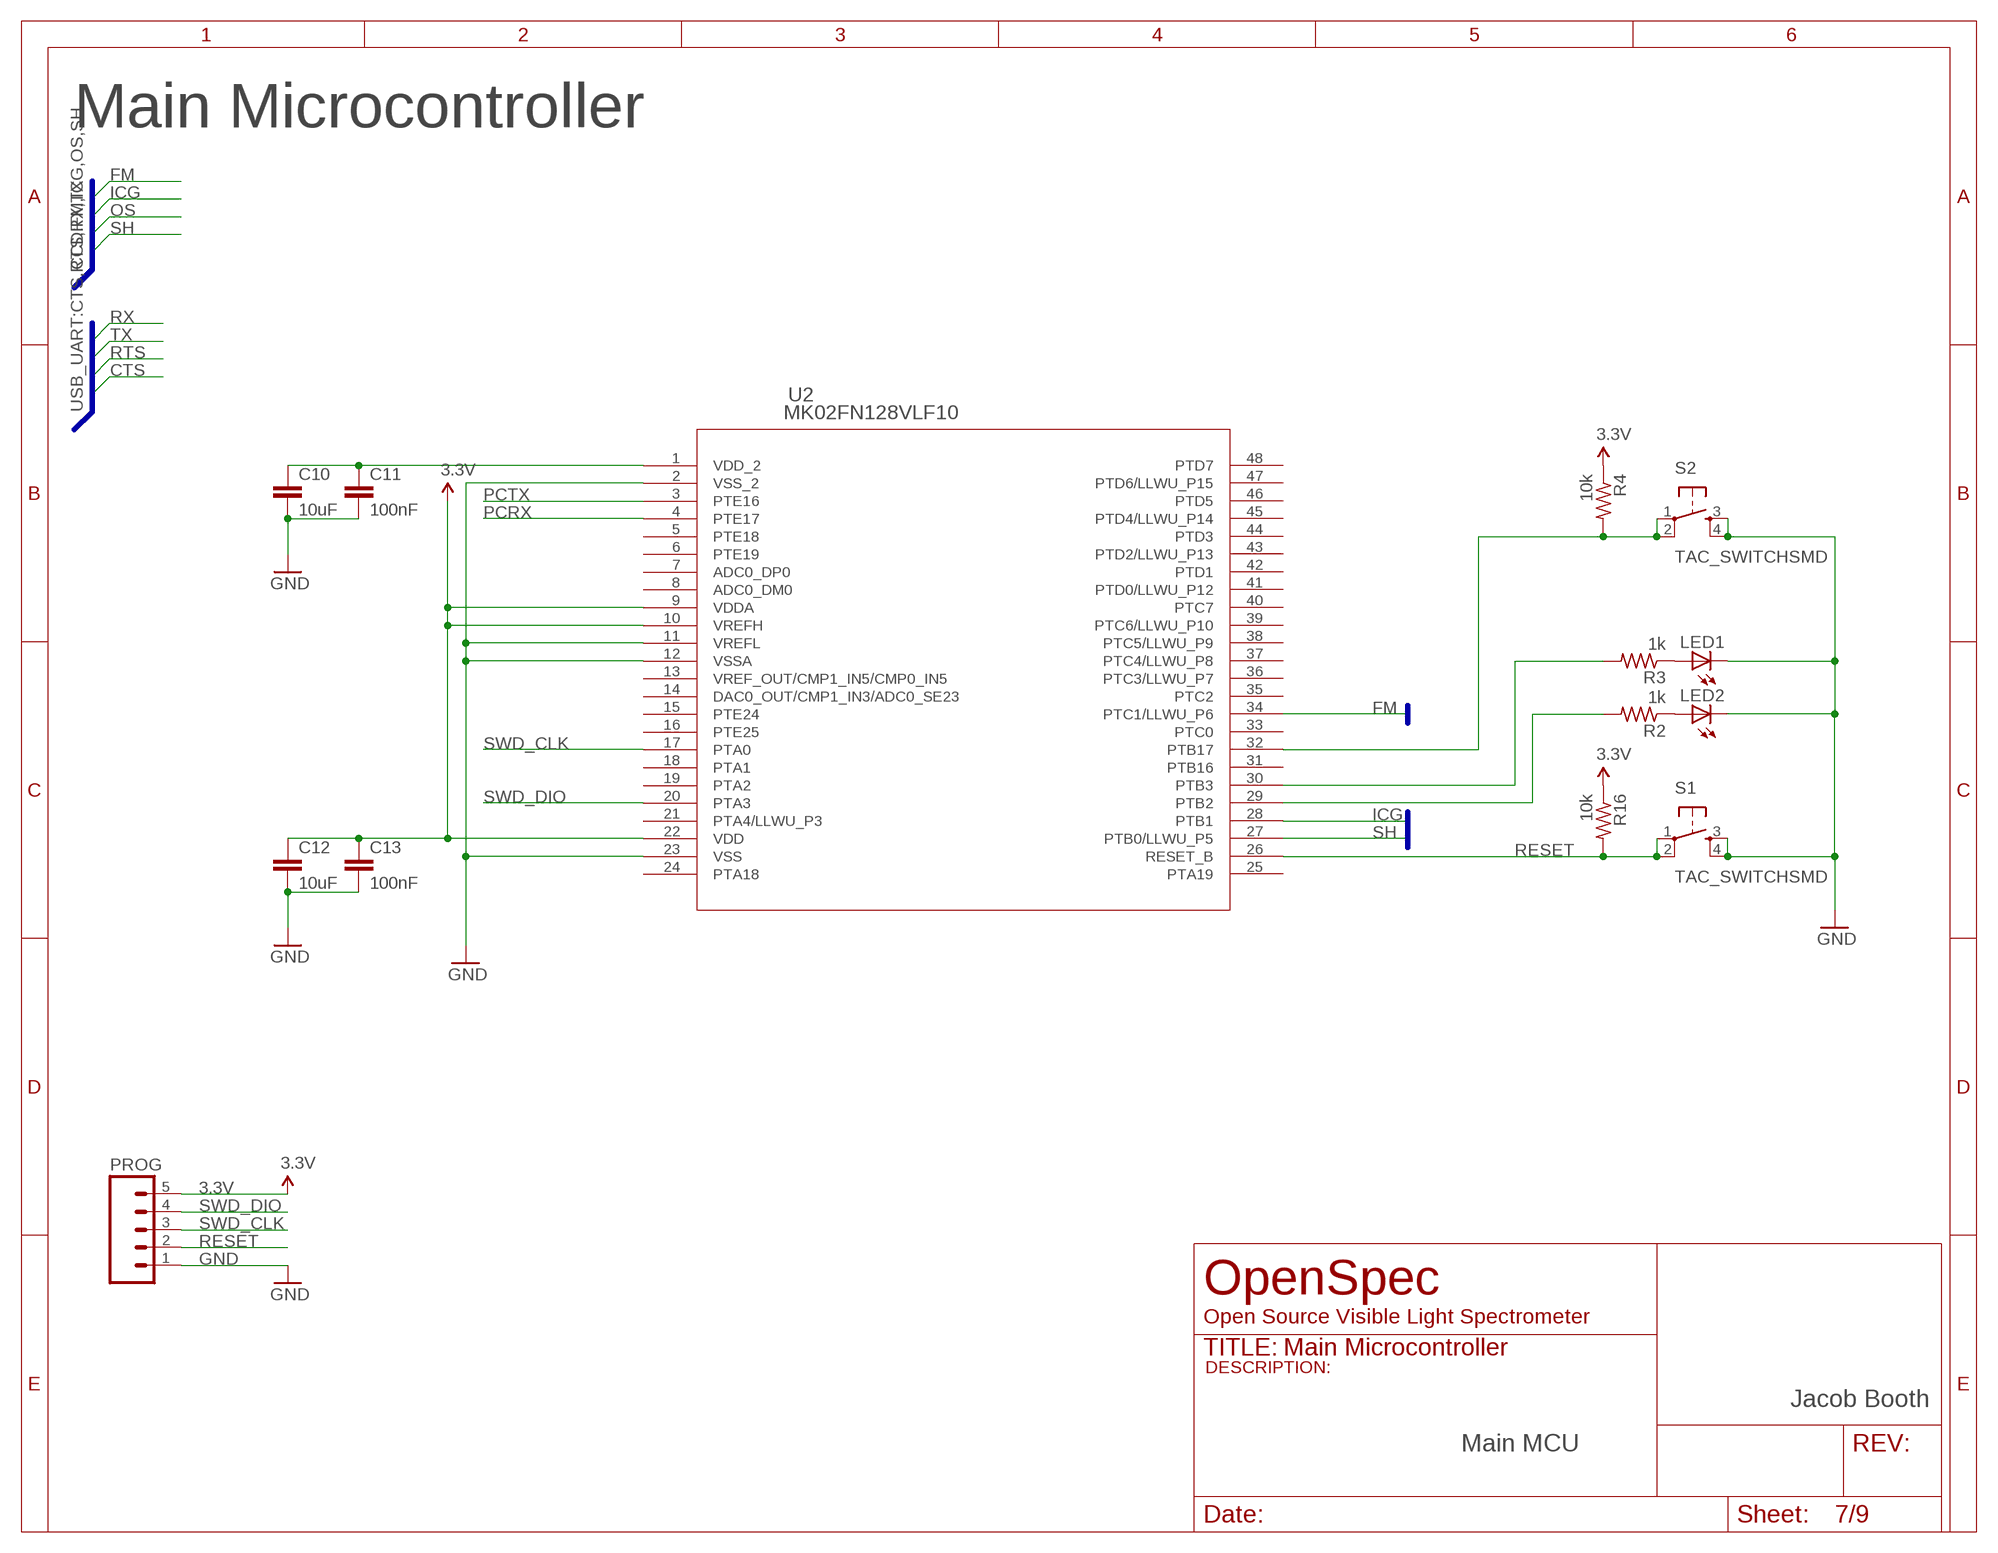
[diagram p6: schematic, sheet 7]

### Parts
C10  10uF  0.1UF-0603-25V-(+80/-20%)  [0603]
C11  100nF  0.1UF-0603-25V-(+80/-20%)  [0603]
C12  10uF  0.1UF-0603-25V-(+80/-20%)  [0603]
C13  100nF  0.1UF-0603-25V-(+80/-20%)  [0603]
LED1  LEDCHIPLED_0805  [CHIPLED_0805]
LED2  LEDCHIPLED_0805  [CHIPLED_0805]
PROG  M05LOCK  [1X05_LOCK]
R2  1k  R-US_R0603  [R0603]
R3  1k  R-US_R0603  [R0603]
R4  10k  R-US_R0603  [R0603]
R16  10k  R-US_R0603  [R0603]
S1  TAC_SWITCHSMD  [TACTILE-SWITCH-SMD]
S2  TAC_SWITCHSMD  [TACTILE-SWITCH-SMD]
U2  MK02FN128VLF10  [LQFP-48_7X7X1.6]

### Nets
3.3V: C12.1 C13.1 PROG.5 R4.1 R16.1 U2.9(VDDA) U2.10(VREFH) U2.22(VDD) ; also sheet 3,4,5,8,9
FM: U2.34(PTC1/LLWU_P6) ; also sheet 4
GND: C10.2 C11.2 C12.2 C13.2 LED1.C LED2.C PROG.1 S1.3 S1.4 S2.3 S2.4 U2.2(VSS_2) U2.11(VREFL) U2.12(VSSA) U2.23(VSS) ; also sheet 2,3,5,6,8,9
ICG: U2.28(PTB1) ; also sheet 4
N$7: R4.2 S2.1 S2.2 U2.32(PTB17)
N$11: R3.2 U2.30(PTB3)
N$12: LED1.A R3.1
N$15: R2.2 U2.29(PTB2)
N$26: LED2.A R2.1
N$37: C10.1 C11.1 U2.1(VDD_2)
PCRX: U2.4(PTE17)
PCTX: U2.3(PTE16)
RESET: PROG.2 R16.2 S1.1 S1.2 U2.26(RESET_B) ; also sheet 6
SH: U2.27(PTB0/LLWU_P5) ; also sheet 4
SWD_CLK [data]: PROG.3 U2.17(PTA0)
SWD_DIO [data]: PROG.4 U2.20(PTA3)
Unconnected: U2.5(PTE18) U2.6(PTE19) U2.7(ADC0_DP0) U2.8(ADC0_DM0) U2.13(VREF_OUT/CMP1_IN5/CMP0_IN5) U2.14(DAC0_OUT/CMP1_IN3/ADC0_SE23) U2.15(PTE24) U2.16(PTE25) U2.18(PTA1) U2.19(PTA2) U2.21(PTA4/LLWU_P3) U2.24(PTA18) U2.25(PTA19) U2.31(PTB16) U2.33(PTC0) U2.35(PTC2) U2.36(PTC3/LLWU_P7) U2.37(PTC4/LLWU_P8) U2.38(PTC5/LLWU_P9) U2.39(PTC6/LLWU_P10) U2.40(PTC7) U2.41(PTD0/LLWU_P12) U2.42(PTD1) U2.43(PTD2/LLWU_P13) U2.44(PTD3) U2.45(PTD4/LLWU_P14) U2.46(PTD5) U2.47(PTD6/LLWU_P15) U2.48(PTD7)

### Buses
CCD:FM,ICG,OS,SH
USB_UART:CTS,RTS,RX,TX

### Notes on the sheet
- Jacob Booth
- Main MCU

## Sheet 8 of 9: SD Card
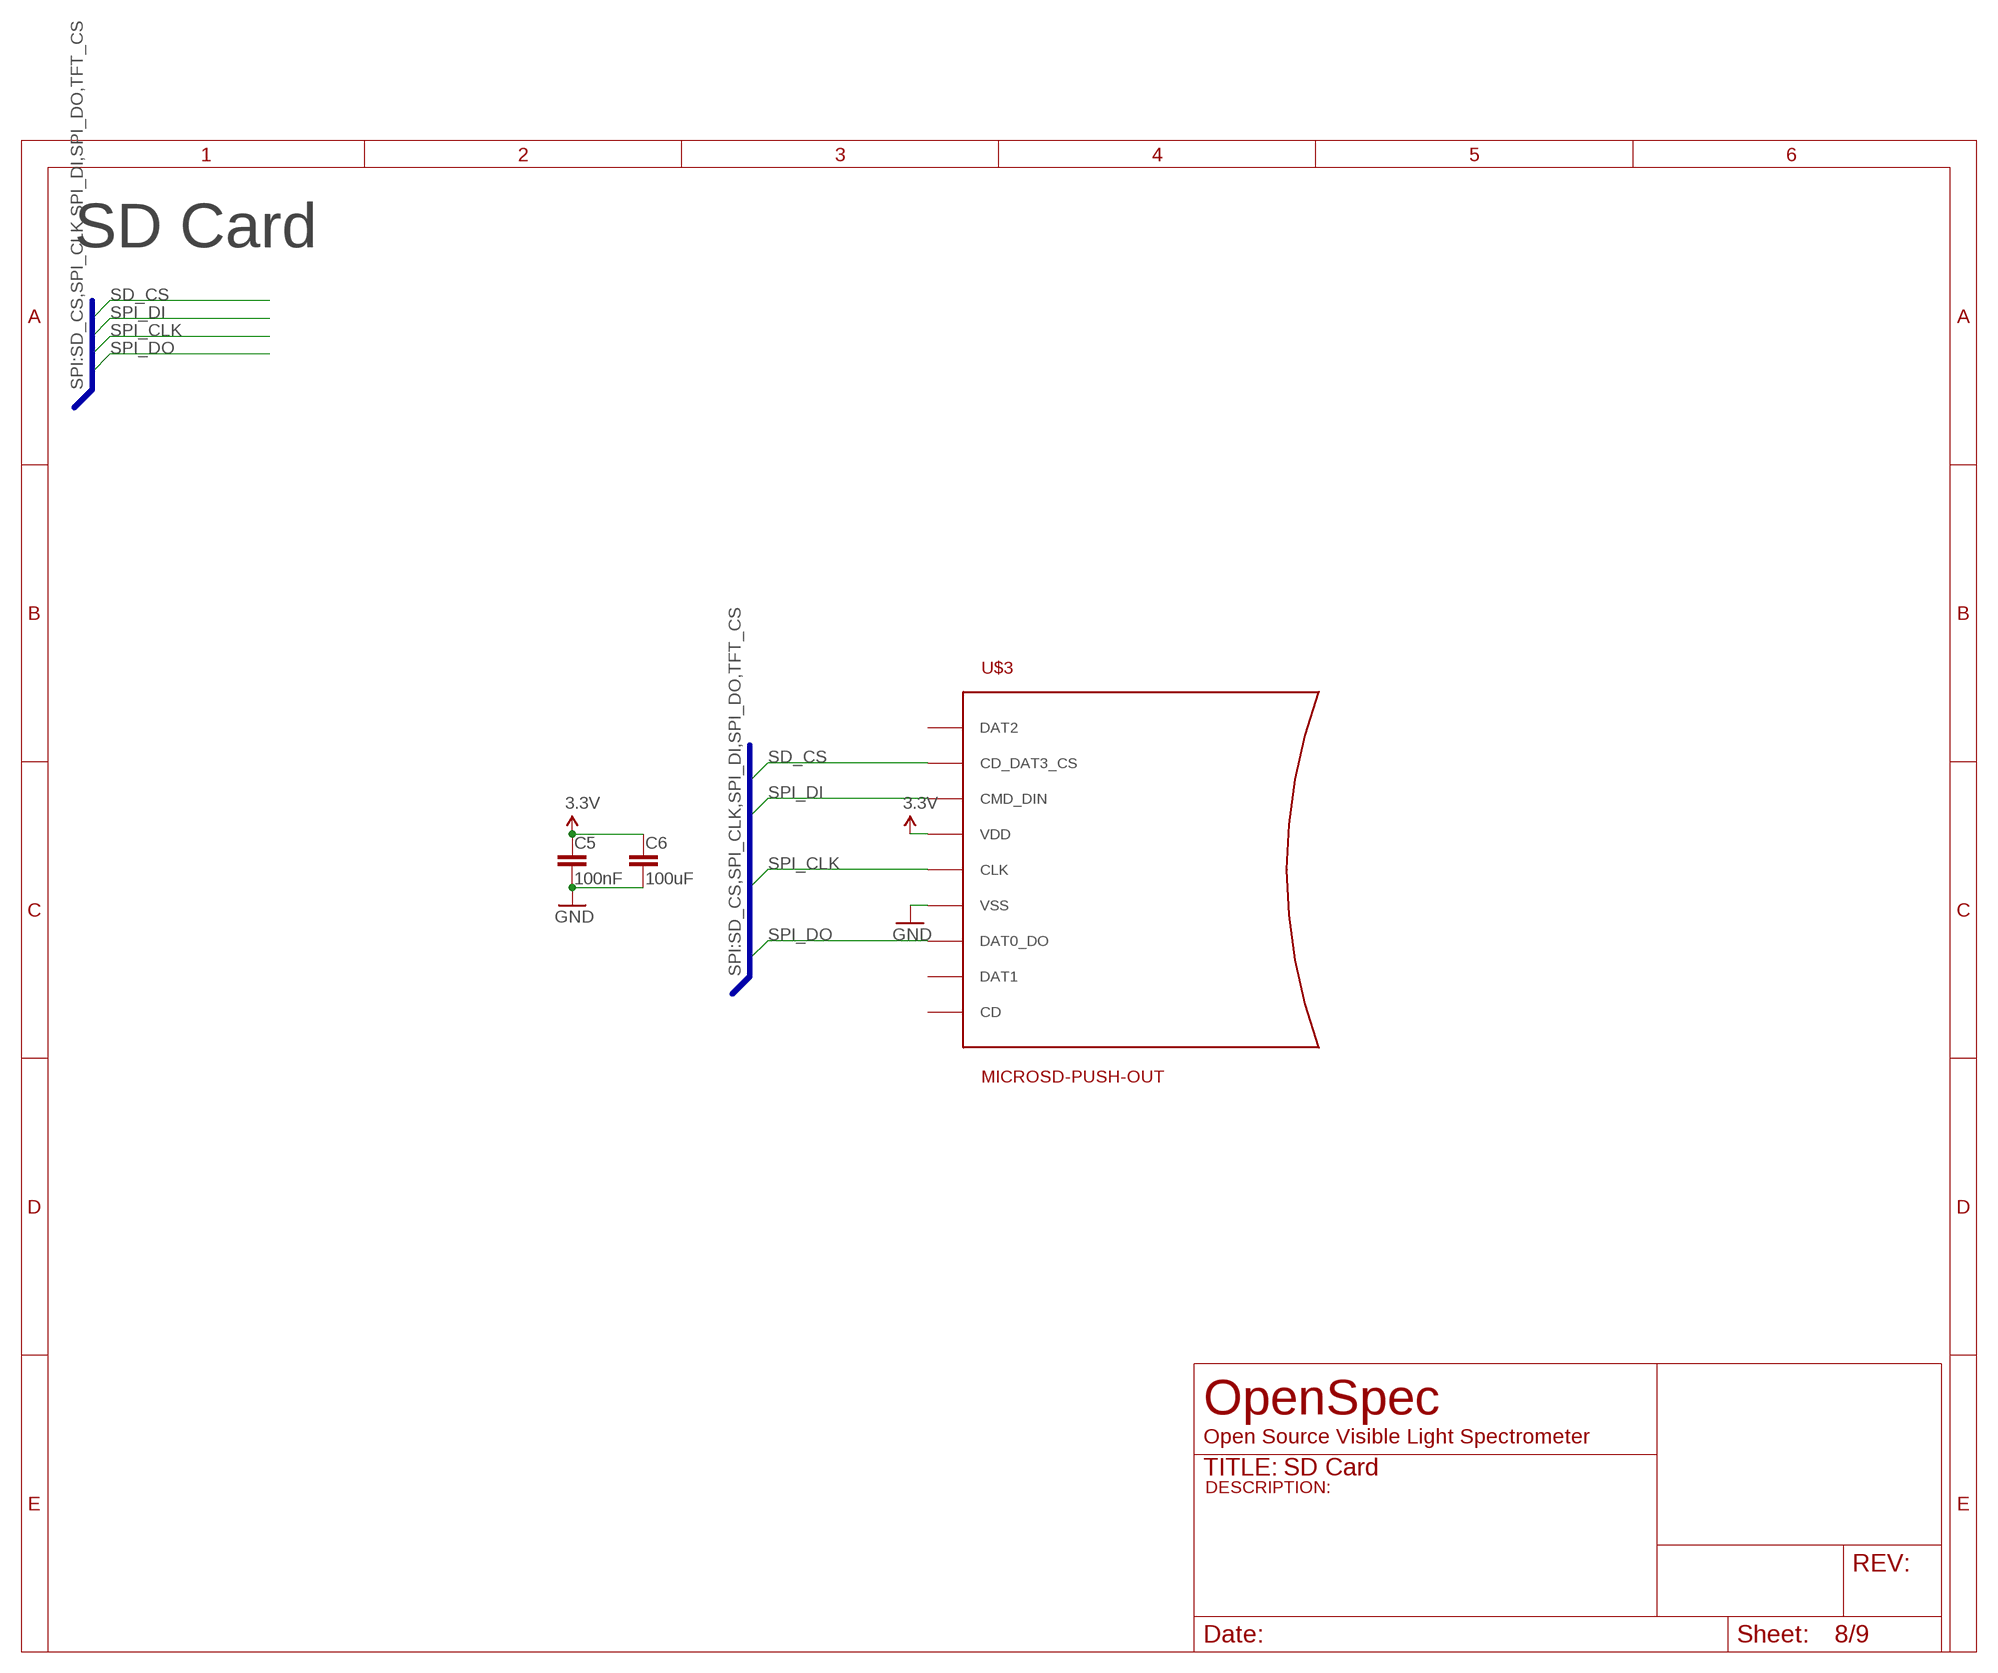
[diagram p7: schematic, sheet 8]

### Parts
C5  100nF  10PF-50V-5%(0603)  [0603-CAP]
C6  100uF  10PF-50V-5%(0603)  [0603-CAP]
U$3  MICROSD-PUSH-OUT  [MICROSD-PUSH-OUT]

### Nets
3.3V: C5.1 C6.1 U$3.4(VDD) ; also sheet 3,4,5,7,9
GND: C5.2 C6.2 U$3.6(VSS) U$3.G1(VSS) U$3.G2(VSS) U$3.G3(VSS) U$3.G4(VSS) ; also sheet 2,3,5,6,7,9
SD_CS: U$3.2(CD_DAT3_CS)
SPI_CLK: U$3.5(CLK) ; also sheet 5
SPI_DI: U$3.3(CMD_DIN) ; also sheet 5
SPI_DO: U$3.7(DAT0_DO) ; also sheet 5
Unconnected: U$3.1(DAT2) U$3.8(DAT1) U$3.CD

### Buses
SPI:SD_CS,SPI_CLK,SPI_DI,SPI_DO,TFT_CS

## Sheet 9 of 9: Peltier Driver
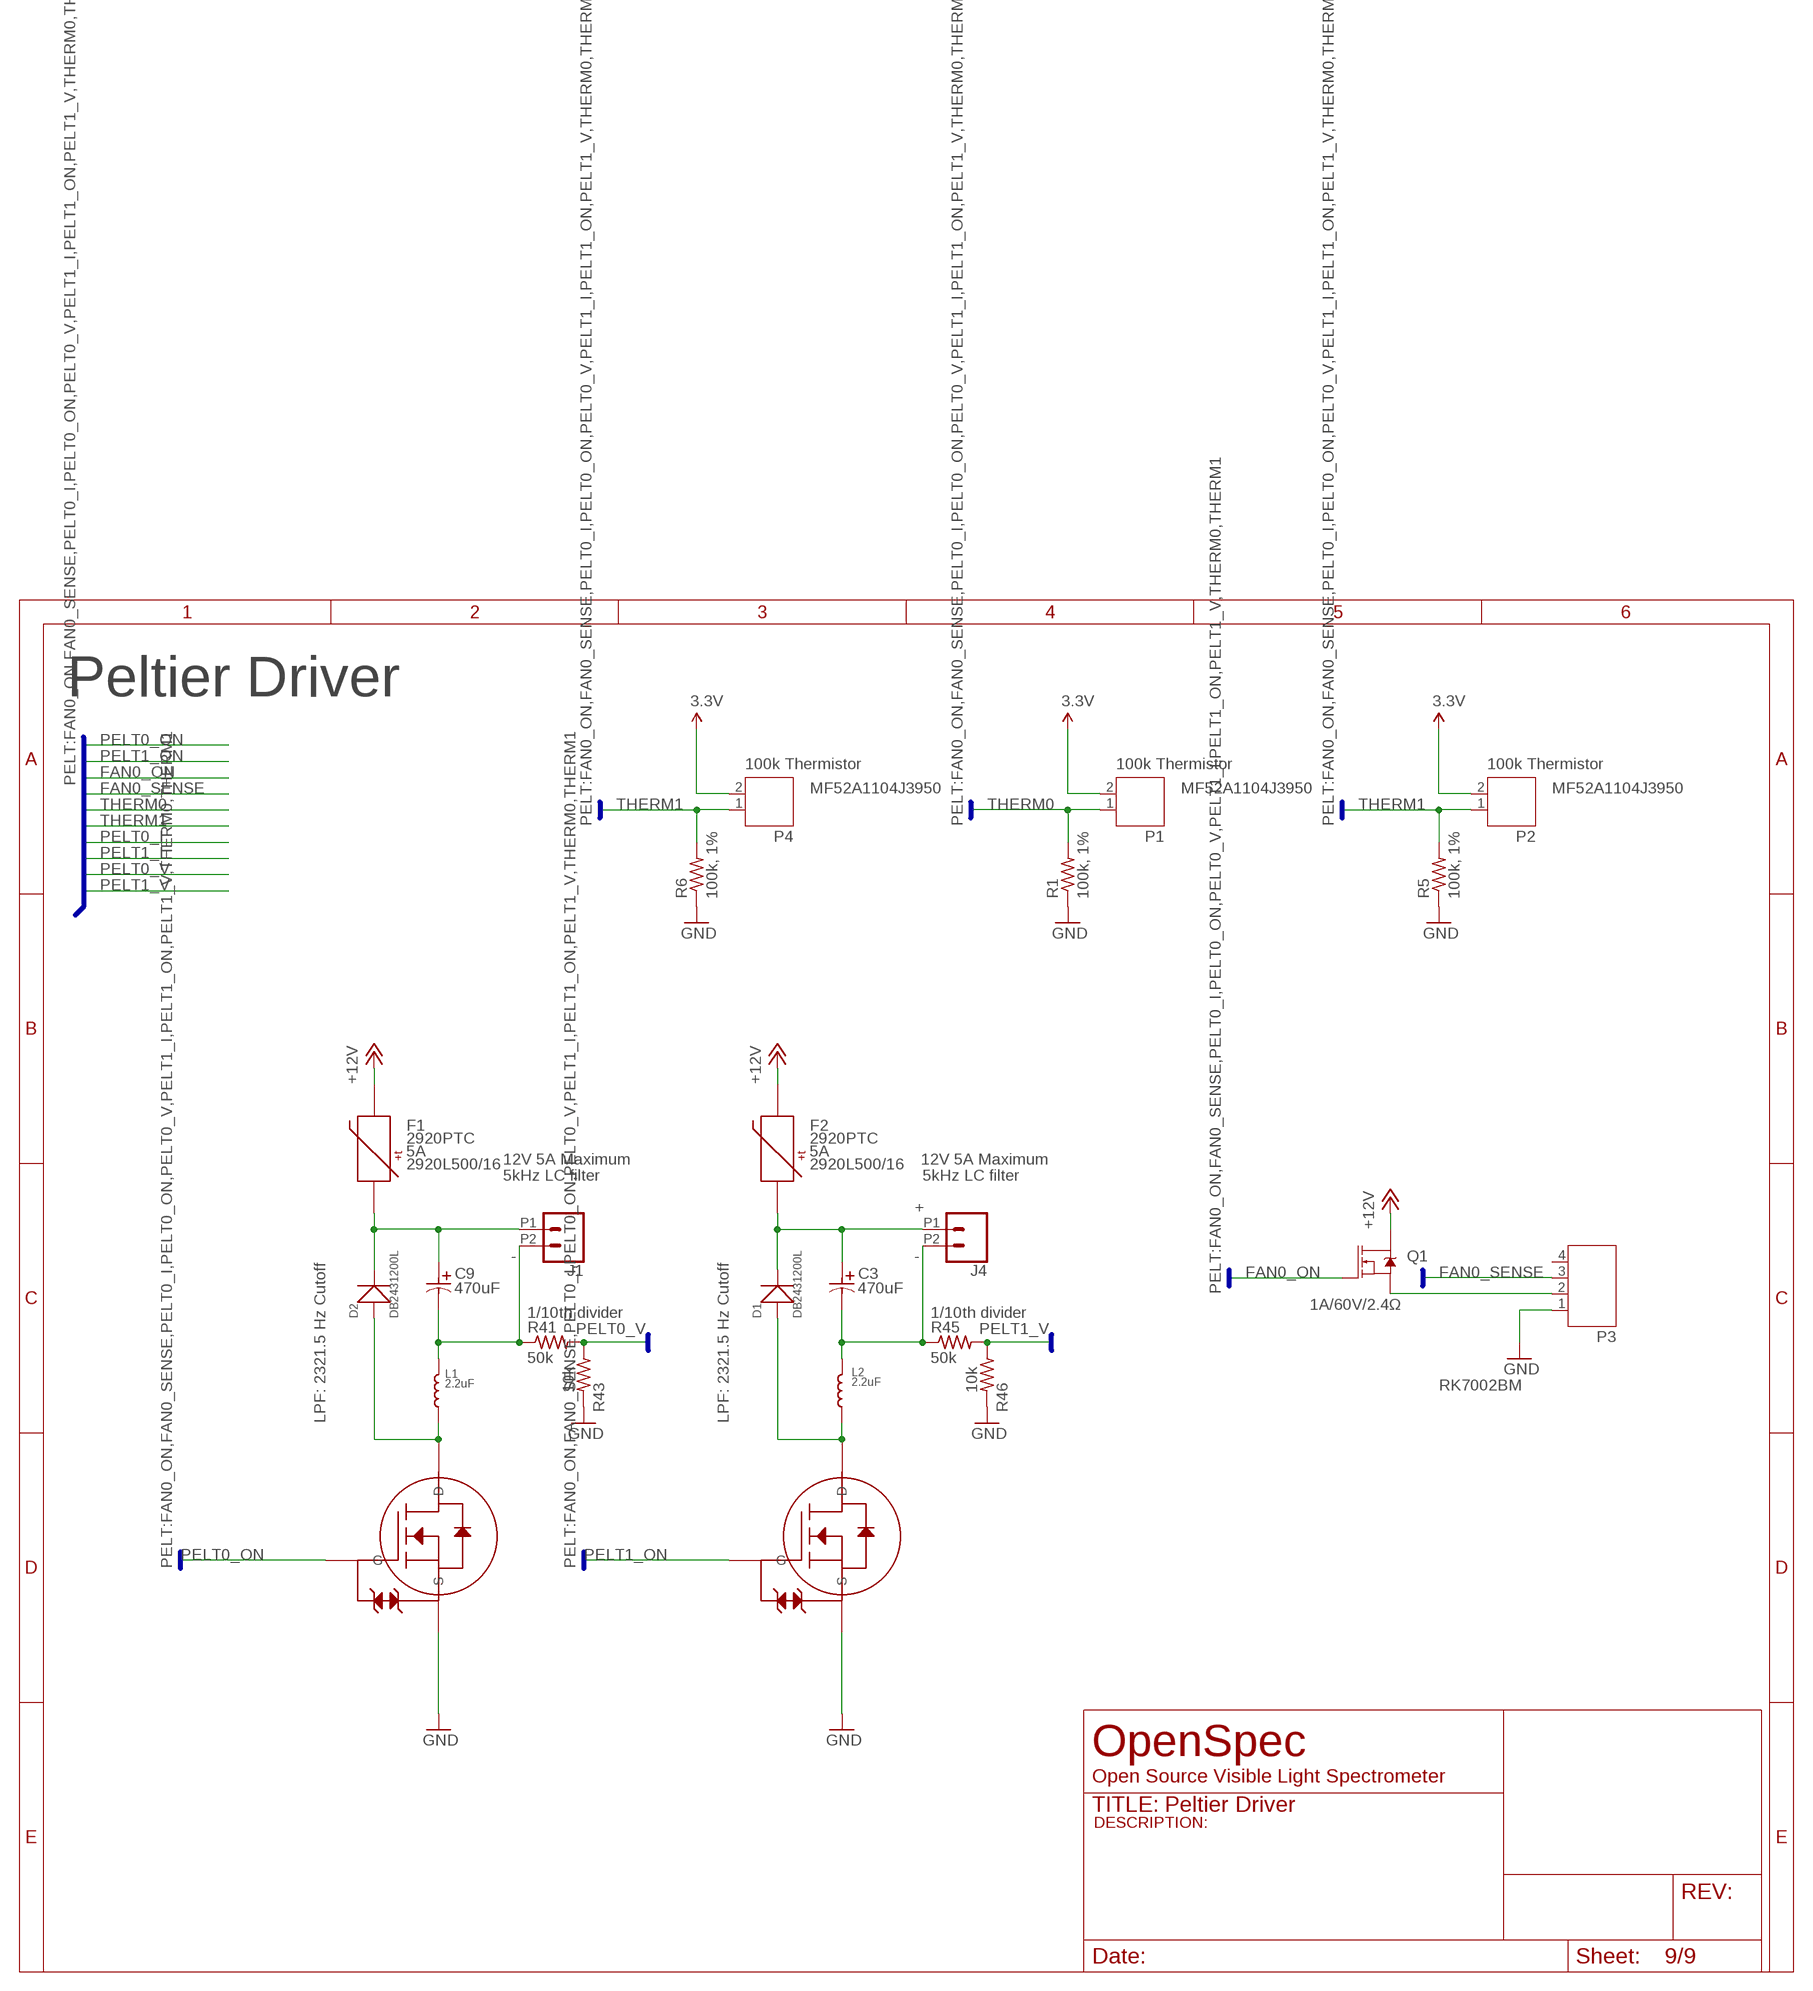
[diagram p8: schematic, sheet 9]

### Parts
C3  470uF  UWT1C471MNL1GS  [PCAP_8X10-ELECT]
C9  470uF  UWT1C471MNL1GS  [PCAP_8X10-ELECT]
D1  DB2431200L  [DB2431200L]
D2  DB2431200L  [DB2431200L]
F1  2920PTC  [2920]
F2  2920PTC  [2920]
J1  CONN_022.54MM_SCREWTERM  [1X02_2.54_SCREWTERM]
J4  CONN_022.54MM_SCREWTERM  [1X02_2.54_SCREWTERM]
L1  2.2uF  VLS6045EX  [VLS6045EX]
L2  2.2uF  VLS6045EX  [VLS6045EX]
P1  JST-PH2  [JST-PH2]
P2  JST-PH2  [JST-PH2]
P3  JST-PH4  [JST-PH4]
P4  JST-PH2  [JST-PH2]
Q1  1A/60V/2.4Ω  MOSFET-NCH-BSS138  [SOT23-3]
R1  100k, 1%  R-US_R0603  [R0603]
R5  100k, 1%  R-US_R0603  [R0603]
R6  100k, 1%  R-US_R0603  [R0603]
R41  50k  R-US_R0603  [R0603]
R43  10k  R-US_R0603  [R0603]
R45  50k  R-US_R0603  [R0603]
R46  10k  R-US_R0603  [R0603]
U$1  DMN1019UVT  [TSOT26]
U$4  DMN1019UVT  [TSOT26]

### Nets
3.3V: P1.2 P2.2 P4.2 ; also sheet 3,4,5,7,8
+12V: F1.P$1 F2.P$1 Q1.3(D) ; also sheet 2
FAN0_ON: Q1.1(G)
FAN0_SENSE: P3.3
GND: P3.1 R1.1 R5.1 R6.1 R43.2 R46.2 U$1.P$4(S) U$4.P$4(S) ; also sheet 2,3,5,6,7,8
N$1: C3.2 J4.P2 L2.2 R45.1
N$2: D1.P$1(+) L2.1 U$1.P$1(D) U$1.P$2(D) U$1.P$5(D) U$1.P$6(D)
N$13: P3.2 Q1.2(S)
N$16: C9.2 J1.P2 L1.2 R41.1
N$17: D2.P$1(+) L1.1 U$4.P$1(D) U$4.P$2(D) U$4.P$5(D) U$4.P$6(D)
N$18: C9.1 D2.P$2(-) F1.P$2 J1.P1
N$21: C3.1 D1.P$2(-) F2.P$2 J4.P1
PELT0_ON: U$4.P$3(G)
PELT0_V: R41.2 R43.1
PELT1_ON: U$1.P$3(G)
PELT1_V: R45.2 R46.1
THERM0: P1.1 R1.2
THERM1: P2.1 P4.1 R5.2 R6.2
Unconnected: P3.4

### Buses
PELT:FAN0_ON,FAN0_SENSE,PELT0_I,PELT0_ON,PELT0_V,PELT1_I,PELT1_ON,PELT1_V,THERM0,THERM1

### Notes on the sheet
- 100k Thermistor | 100k Thermistor | 100k Thermistor
- MF52A1104J3950 | MF52A1104J3950 | MF52A1104J3950
- 12V 5A Maximum | 12V 5A Maximum
- 5kHz LC filter | 5kHz LC filter
- +
- - | -
- 1/10th divider | 1/10th divider
- RK7002BM
- LPF: 2321.5 Hz Cutoff | LPF: 2321.5 Hz Cutoff

## Power pins joined to a net without a drawn wire
AVDD: U4.2(AVDD)
DVDD: U4.16(DVDD)
EPAD: U4.17(EPAD)
GND: U4.1(GND)
REF: U4.3(REF)
REFGND: U4.4(REFGND)
VDD: U5.6(VDD)

## Library data of the parts
C1 C2 C5-C8 C14-C16 C20 C21 C70 = SparkFun-Capacitors:10PF-50V-5%(0603): CAP-11812; PROD_ID: CAP-11812; VALUE: 10pF
C3 C9 = PhotoSpec_Parts:UWT1C471MNL1GS; MANUFACTURER_PART_NUMBER: UWT1C471MNL1GS; VENDOR: Nichicon
C4 = resistor:C-EU: CAPACITOR, European symbol
C10-C13 = SparkFun-Capacitors:0.1UF: 0.1µF ceramic capacitors A capacitor is a passive two-terminal electrical component used to store electrical energy temporarily in an electric field.; PROD_ID: CAP-00810; VALUE: 0.1uF
C17 = UWT1H101MNL1GS:UWT1H101MNL1GS; CAPACITANCE: 100uF; MANUFACTURER_PART_NUMBER: UWT1H101MNL1GS; VENDOR: Nichicon; VOLTAGE: 50V
C18 C19 C30 = eagle-ltspice:C: CAPACITOR, European symbol; PARTNO: 490-12456-1-ND; SPICEMODEL: NONE; SPICEPREFIX: C; VOLTAGE: 50V
C22 C53 = caps:UWZ1C151MCL1GS; CAPACITANCE: 220uF; MANUFACTURER_PART_NUMBER: UWT1C221MCL1GS; VENDOR: Nichicon; VOLTAGE: 16V
C23 C31 C36 = SparkFun-Capacitors:10PF-50V-5%(0603): CAP-11812; PARTNO: 311-1343-1-ND; PROD_ID: CAP-11812; TOLERANCE: 5%; VALUE: 10pF; VOLTAGE: 50V
C24 C55 = SparkFun-Capacitors:10PF-50V-5%(0603): CAP-11812; PARTNO: 1276-1102-1-ND; PROD_ID: CAP-11812; VALUE: 10pF; VOLTAGE: 25V
C25 C45 C46 C48 C54 = eagle-ltspice:C: CAPACITOR, European symbol; PARTNO: 1276-1075-1-ND; SPICEMODEL: NONE; SPICEPREFIX: C; VOLTAGE: 25V
C26 C28 C29 C33 C47 = rcl:C-EU: CAPACITOR, European symbol; PARTNO: 1276-2957-1-ND; SPICEPREFIX: C; VOLTAGE: 16V
C27 C35 = SparkFun-Capacitors:10PF-50V-5%(0603): CAP-11812; PARTNO: 311-1343-1-ND; PROD_ID: CAP-11812; VALUE: 10pF; VOLTAGE: 50V
C32 = SparkFun-Capacitors:10PF-50V-5%(0603): CAP-11812; PARTNO: 1276-1119-1-ND; PROD_ID: CAP-11812; VALUE: 10pF; VOLTAGE: 6.3V
C34 = rcl:C-EU: CAPACITOR, European symbol; PARTNO: 1276-1096-1-ND; SPICEPREFIX: C; VOLTAGE: 16V
C37 = SparkFun-Capacitors:10PF-50V-5%(0603): CAP-11812; PARTNO: 311-1343-1-ND; PROD_ID: CAP-11812; TOLERANCE: 5%; VOLTAGE: 50V
C38 = caps:UWZ1C151MCL1GS; CAPACITANCE: 150uF; MANUFACTURER_PART_NUMBER: UWZ1C151MCL1GS; VENDOR: Nichicon; VOLTAGE: 16V
C39 C95 = SparkFun-Capacitors:10PF-50V-5%(0603): CAP-11812; PARTNO: 1276-1062-1-ND; PROD_ID: CAP-11812; VALUE: 10pF; VOLTAGE: 16V
C40 = SparkFun-Capacitors:10PF-50V-5%(0603): CAP-11812; PARTNO: 1276-1045-1-ND; PROD_ID: CL10A475KQ8NNNC; VALUE: 10pF; VOLTAGE: 6.3V
C41 = SparkFun-Capacitors:10PF-50V-5%(0603): CAP-11812; PARTNO: 445-6933-1-ND; PROD_ID: CGA3E1X7R0J225K080AC; VALUE: 10pF; VOLTAGE: 6.3V
C43 = UWT1H101MNL1GS:UWT1H101MNL1GS; CAPACITANCE: 100uF; MANUFACTURER_PART_NUMBER: UWT1H101MNL1GS; VENDOR: Nichicon
C49 C50 = caps:UWZ1C151MCL1GS; CAPACITANCE: 100uF; MANUFACTURER_PART_NUMBER: UWZ1C151MCL1GS; VENDOR: Nichicon; VOLTAGE: 16V
C51 C52 C56 = rcl:C-EU: CAPACITOR, European symbol; PARTNO: 490-12389-1-ND; SPICEPREFIX: C; VOLTAGE: 25V
CR1 = fuses:SMAJ54CA; ESD: 30kV; MANUFACTURER_PART_NUMBER: SMAJ54CA; PEAKPOWER: 400W; VENDOR: Littelfuse Inc
D1 D2 = DMN1019UVT:DB2431200L
D3 D4 = diode:ZENER-DIODE: Z-Diode
D13 = TPD1E10B06DPYR:TPD1E10B06DPYR: Single Channel ESD in 0402 package with 10pF Capacitance and 6V Breakdown 2-X1SON -40 to 125; DESCRIPTION: Single Channel ESD in 0402 package with 10pF Capacitance and 6V Breakdown 2-X1SON -40 to 125; DIGI-KEY_PART_NUMBER: 296-30406-1-ND; DIGI-KEY_PURCHASE_URL: https://www.digikey.ca/product-detail/en/texas-instruments/TPD1E10B06DPYR/296-30406-1-ND/3283560?utm_source=snapeda&utm_medium=aggregator&utm_campaign=symbol; MF: Texas Instruments; MP: TPD1E10B06DPYR; PACKAGE: XDFN-2 Texas Instruments
F1 F2 = fuses:2920PTC; IHOLD: 5A; PARTNO: 2920L500/16
F5 = fuses:2920PTC; IHOLD: 1.1A; PARTNO: 2920L110/60
F6 = fuses:2920PTC; IHOLD: 3A; PARTNO: 2920L300
J1 J4 = SparkFun-Connectors:CONN_02: Multi connection point. Often used as Generic Header-pin footprint for 0.1 inch spaced/style header connections On any of the 0.1 inch spaced packages, you can populate with these: Break Away Headers - Straight <https://www.sparkfun.com/products/116> (PRT-00116) Break Away Male Headers - Right Angle <https://www.sparkfun.com/products/553> (PRT-00553) Female Headers <https://www.sparkfun.com/products/115> (PRT-00115) Break Away Headers - Machine Pin <https://www.sparkfun.com/products/117> (PRT-00117) Break Away Female Headers - Swiss Machine Pin <https://www.sparkfun.com/products/743> (PRT-00743) For SCREWTERMINALS and SPRING TERMINALS visit here: Screw Terimnals on SparkFun.com <https://www.sparkfun.com/search/results?term=Screw+Terminals> (5mm/3.5mm/2.54mm spacing) This device is also useful as a general connection point to wire up your design to another part of your project. Our various solder wires solder well into these plated through hole pads. Hook-Up Wire - Assortment (Stranded, 22 AWG) <https://www.sparkfun.com/products/11375> (PRT-11375) Hook-Up Wire - Assortment (Solid Core, 22 AWG) <https://www.sparkfun.com/products/11367> (PRT-11367) View the entire wire category on our website here <https://www.sparkfun.com/categories/141> Special notes: Molex polarized connector foot print use with: PRT-08233 with associated crimp pins and housings. 2.54_SCREWTERM for use with PRT-10571. 3.5mm Screw Terminal footprints for PRT-08084 5mm Screw Terminal footprints for use with PRT-08432
J2 = SparkFun-Connectors:USB_MICRO-B: USB Type Micro-B Connector Male/female and PTH/SMT variants SparkFun Products: SparkFun microB USB Breakout <https://www.sparkfun.com/products/12035> SparkFun USB microB Plug Breakout <https://www.sparkfun.com/products/10031> SparkFun ESP8266 Thing <https://www.sparkfun.com/products/13231>; PROD_ID: CONN-11752
J5 = SparkFun-Connectors:CONN_02: Multi connection point. Often used as Generic Header-pin footprint for 0.1 inch spaced/style header connections On any of the 0.1 inch spaced packages, you can populate with these: Break Away Headers - Straight <https://www.sparkfun.com/products/116> (PRT-00116) Break Away Male Headers - Right Angle <https://www.sparkfun.com/products/553> (PRT-00553) Female Headers <https://www.sparkfun.com/products/115> (PRT-00115) Break Away Headers - Machine Pin <https://www.sparkfun.com/products/117> (PRT-00117) Break Away Female Headers - Swiss Machine Pin <https://www.sparkfun.com/products/743> (PRT-00743) For SCREWTERMINALS and SPRING TERMINALS visit here: Screw Terimnals on SparkFun.com <https://www.sparkfun.com/search/results?term=Screw+Terminals> (5mm/3.5mm/2.54mm spacing) This device is also useful as a general connection point to wire up your design to another part of your project. Our various solder wires solder well into these plated through hole pads. Hook-Up Wire - Assortment (Stranded, 22 AWG) <https://www.sparkfun.com/products/11375> (PRT-11375) Hook-Up Wire - Assortment (Solid Core, 22 AWG) <https://www.sparkfun.com/products/11367> (PRT-11367) View the entire wire category on our website here <https://www.sparkfun.com/categories/141> Special notes: Molex polarized connector foot print use with: PRT-08233 with associated crimp pins and housings. 2.54_SCREWTERM for use with PRT-10571. 3.5mm Screw Terminal footprints for PRT-08084 5mm Screw Terminal footprints for use with PRT-08432; PROD_ID: CONN-08399
JACK1 = con-dcjack:JACK-C-PC-10A-RA(R); PARTNO: 1939-1086-ND; VOLTAGE: 50V
JP4 = pinhead:PINHD-1X2: PIN HEADER
L1 L2 = PhotoSpec_Parts:VLS6045EX; INDUCTANCE: 2.2uF; PARTNO: VLS6045EX-2R2N-CA
L3 L9 = LM2776DBVR:CIGW252010GLR47MNE; INDUCTANCE: 1.5uH
L11 = LMR23630:486R8SC; INDUCTANCE: 6.8uH
LED1 LED2 = led:LED: LED OSRAM: - CHIPLED LG R971, LG N971, LY N971, LG Q971, LY Q971, LO R971, LY R971 LH N974, LH R974 LS Q976, LO Q976, LY Q976 LO Q996 - Hyper CHIPLED LW Q18S LB Q993, LB Q99A, LB R99A - SideLED LS A670, LO A670, LY A670, LG A670, LP A670 LB A673, LV A673, LT A673, LW A673 LH A674 LY A675 LS A676, LA A676, LO A676, LY A676, LW A676 LS A679, LY A679, LG A679 - Hyper Micro SIDELED® LS Y876, LA Y876, LO Y876, LY Y876 LT Y87S - SmartLED LW L88C, LW L88S LB L89C, LB L89S, LG L890 LS L89K, LO L89K, LY L89K LS L896, LA L896, LO L896, LY L896 - TOPLED LS T670, LO T670, LY T670, LG T670, LP T670 LSG T670, LSP T670, LSY T670, LOP T670, LYG T670 LG T671, LOG T671, LSG T671 LB T673, LV T673, LT T673, LW T673 LH T674 LS T676, LA T676, LO T676, LY T676, LB T676, LH T676, LSB T676, LW T676 LB T67C, LV T67C, LT T67C, LS T67K, LO T67K, LY T67K, LW E67C LS E67B, LA E67B, LO E67B, LY E67B, LB E67C, LV E67C, LT E67C LW T67C LS T679, LY T679, LG T679 LS T770, LO T770, LY T770, LG T770, LP T770 LB T773, LV T773, LT T773, LW T773 LH T774 LS E675, LA E675, LY E675, LS T675 LS T776, LA T776, LO T776, LY T776, LB T776 LHGB T686 LT T68C, LB T68C - Hyper Mini TOPLED® LB M676 - Mini TOPLED Santana® LG M470 LS M47K, LO M47K, LY M47K Source: http://www.osram.convergy.de LUXEON: - LUMILED® LXK2-PW12-R00, LXK2-PW12-S00, LXK2-PW14-U00, LXK2-PW14-V00 LXK2-PM12-R00, LXK2-PM12-S00, LXK2-PM14-U00 LXK2-PE12-Q00, LXK2-PE12-R00, LXK2-PE12-S00, LXK2-PE14-T00, LXK2-PE14-U00 LXK2-PB12-K00, LXK2-PB12-L00, LXK2-PB12-M00, LXK2-PB14-N00, LXK2-PB14-P00, LXK2-PB14-Q00 LXK2-PR12-L00, LXK2-PR12-M00, LXK2-PR14-Q00, LXK2-PR14-R00 LXK2-PD12-Q00, LXK2-PD12-R00, LXK2-PD12-S00 LXK2-PH12-R00, LXK2-PH12-S00 LXK2-PL12-P00, LXK2-PL12-Q00, LXK2-PL12-R00 Source: www.luxeon.com KINGBRIGHT: KA-3528ASYC Source: www.kingbright.com
LED14 = lightpipes:SML-LX23; COLOUR: YELLOW
P1 P2 P4 = jst-ph:JST-PH2
P3 = jst-ph:JST-PH4
PROG = SparkFun-Connectors:M05: Header 5 Standard 5-pin 0.1" header. Use with straight break away headers (SKU : PRT-00116), right angle break away headers (PRT-00553), swiss pins (PRT-00743), machine pins (PRT-00117), and female headers (PRT-00115). Molex polarized connector foot print use with SKU : PRT-08230 with associated crimp pins and housings.
Q1 = SparkFun-DiscreteSemi:MOSFET-NCH: N-channel MOSFETs Voltage controlled devices that allow control of high current outputs. SparkFun Products: SparkFun OpenScale <https://www.sparkfun.com/products/13261> SparkFun Digital Sandbox <https://www.sparkfun.com/products/12651> SparkFun Monster Moto Shield <https://www.sparkfun.com/products/10182> SparkFun MOSFET Power Controller <https://www.sparkfun.com/products/11214>; PROD_ID: TRANS-00830; VALUE: 220mA/50V/3.5Ω
Q3 = transistor:*-NPN-: NPN Transistror BF959 corrected 2008.03.06
R1-R6 R16 R18 R19 R31-R34 R36 R40 R41 R43 R45-R47 R51 R53 R54 = audio amplifier example:R-US_: RESISTOR, American symbol
R7-R14 = audio amplifier example:R-US_: RESISTOR, American symbol; SPICEPREFIX: R
R15 R17 = adafruit:R-US_: RESISTOR, American symbol
R20-R27 = audio amplifier example:R-US_: RESISTOR, American symbol; TOLERANCE: 1%
S1 S2 = SparkFun-Retired:TAC_SWITCH: Momentary Switch Button commonly used for reset or general input. Spark Fun Electronics SKU : COM-00097 SMT- SWCH-08247; PROD_ID: SWCH-08247
S3 = SparkFun-Switches:ENCODER-2LED: Illuminated Rotary Encoder w/ 2 LEDs Rotary encoders rotate similarly to potentiometers, but they’re different from potentiometers in that an encoder has full rotation without limits. They output gray code so that you can tell how much and in which direction the encoder has been turned. This encoder has a red/green LED built-in, which shines through the encoder shaft. SparkFun Products Rotary Encoder - Illuminated (Red/Green) <https://www.sparkfun.com/products/10596> (COM-10596) SparkFun Rotary Encoder Breakout - Illuminated (RG/RGB) <https://www.sparkfun.com/products/11722> (BOB-11722); PROD_ID: COMP-11113; SF_SKU: COM-10596
SUPPLY21 = SparkFun-PowerSymbols:2PT_GND_TIE: Dual Ground Supply Power supply symbol for connecting two grounds. SparkFun Products: SparkFun AutoDriver - Stepper Motor Driver <https://www.sparkfun.com/products/11611>
T2 = transistor:BC846: NPN TRANSISTOR
TP2 TP9 = testpad:TP: Test pad
U1 = fuses:BT168GW; MANUFACTURER_PART_NUMBER: BT168GW; VENDOR: Nexperia
U2 = MK02FN128VLF10:MK02FN128VLF10; CPU: ARM Cortex-M4F; FLASHKB: 128; MANUFACTURER_PART_NUMBER: mk02fn128vlf10; MAXFREQUENCY: 100; PINCOUNT: 48; SRAMKB: 16; VENDOR: FREESCALE
U3 = REF3025_DBZ-3:REF3025AIDBZR; MANUFACTURER_PART_NUMBER: REF3025AIDBZR; VENDOR: Texas Instruments
U4 = ADS7946:ADS7946SRTER; MANUFACTURER_PART_NUMBER: ADS7946SRTER; VENDOR: Texas Instruments
U5 = CP2102N-A01-GQFN20R:CP2102N-A01-GQFN20R: Ic Bridge Usb To Uart 20qfn; AVAILABILITY: Good; DESCRIPTION: Ic Bridge Usb To Uart 20qfn; MF: Silicon Labs; MP: CP2102N-A01-GQFN20R; PACKAGE: QFN-20 Silicon Labs; PRICE: 1.34 USD
U6 = L5150BNTR:L5150BNTR: 310030096; CURRENT: 150mA; PARTNO: L5150BNTR; VOLTAGE: 5V
U7-U9 U12 = ADA4807:ADA4807-1ARJZ-R2; MANUFACTURER_PART_NUMBER: ADA48071ARJZR2; VENDOR: Analog Devices Inc
U10 = TPD4S012:TPD4S012DRYR; MANUFACTURER_PART_NUMBER: TPD4S012DRYR; VENDOR: Texas Instruments
U11 = 0ZCJ0050FF2G:0ZCJ0050FF2G; MANUFACTURER_PART_NUMBER: 0ZCJ0050FF2G; VENDOR: Belfuse
U13 = fuses:DMP6023LE-13
U14 = LMR23630:LMR23630
U$ = LM2776DBVR:LM2776DBVR
U$1 U$4 = DMN1019UVT:DMN1019UVT
U$2 = ccd:TCD1304
U$3 = microsd:MICROSD-PUSH-OUT: T-Flash Push-Out Micro SD Card Reader 14.75mm x 14.5mm SMD with external pins
U$10 = adafruit:JD-T1800

## Net classes
1 data: width 0.152 mm
2 power: width 0.508 mm, drill 0.305 mm, clearance 0.203 mm
3 power2: width 0.254 mm